# EasyEDA Pro project Daisy.eprj

# Schematic Schematic

## Sheets
1 Daisy: Board Name: Board1; Create Date: 2025-09-15; Page Name: Daisy; Project Name: Daisy; Schematic Name: Schematic; Update Date: 2025-12-15; Company: EasyEDA.com; Drawn: EasyEDA; Page Size: A4; Part Number: JLCPCB-002; Reviewed: EasyEDA; Version: V0.1
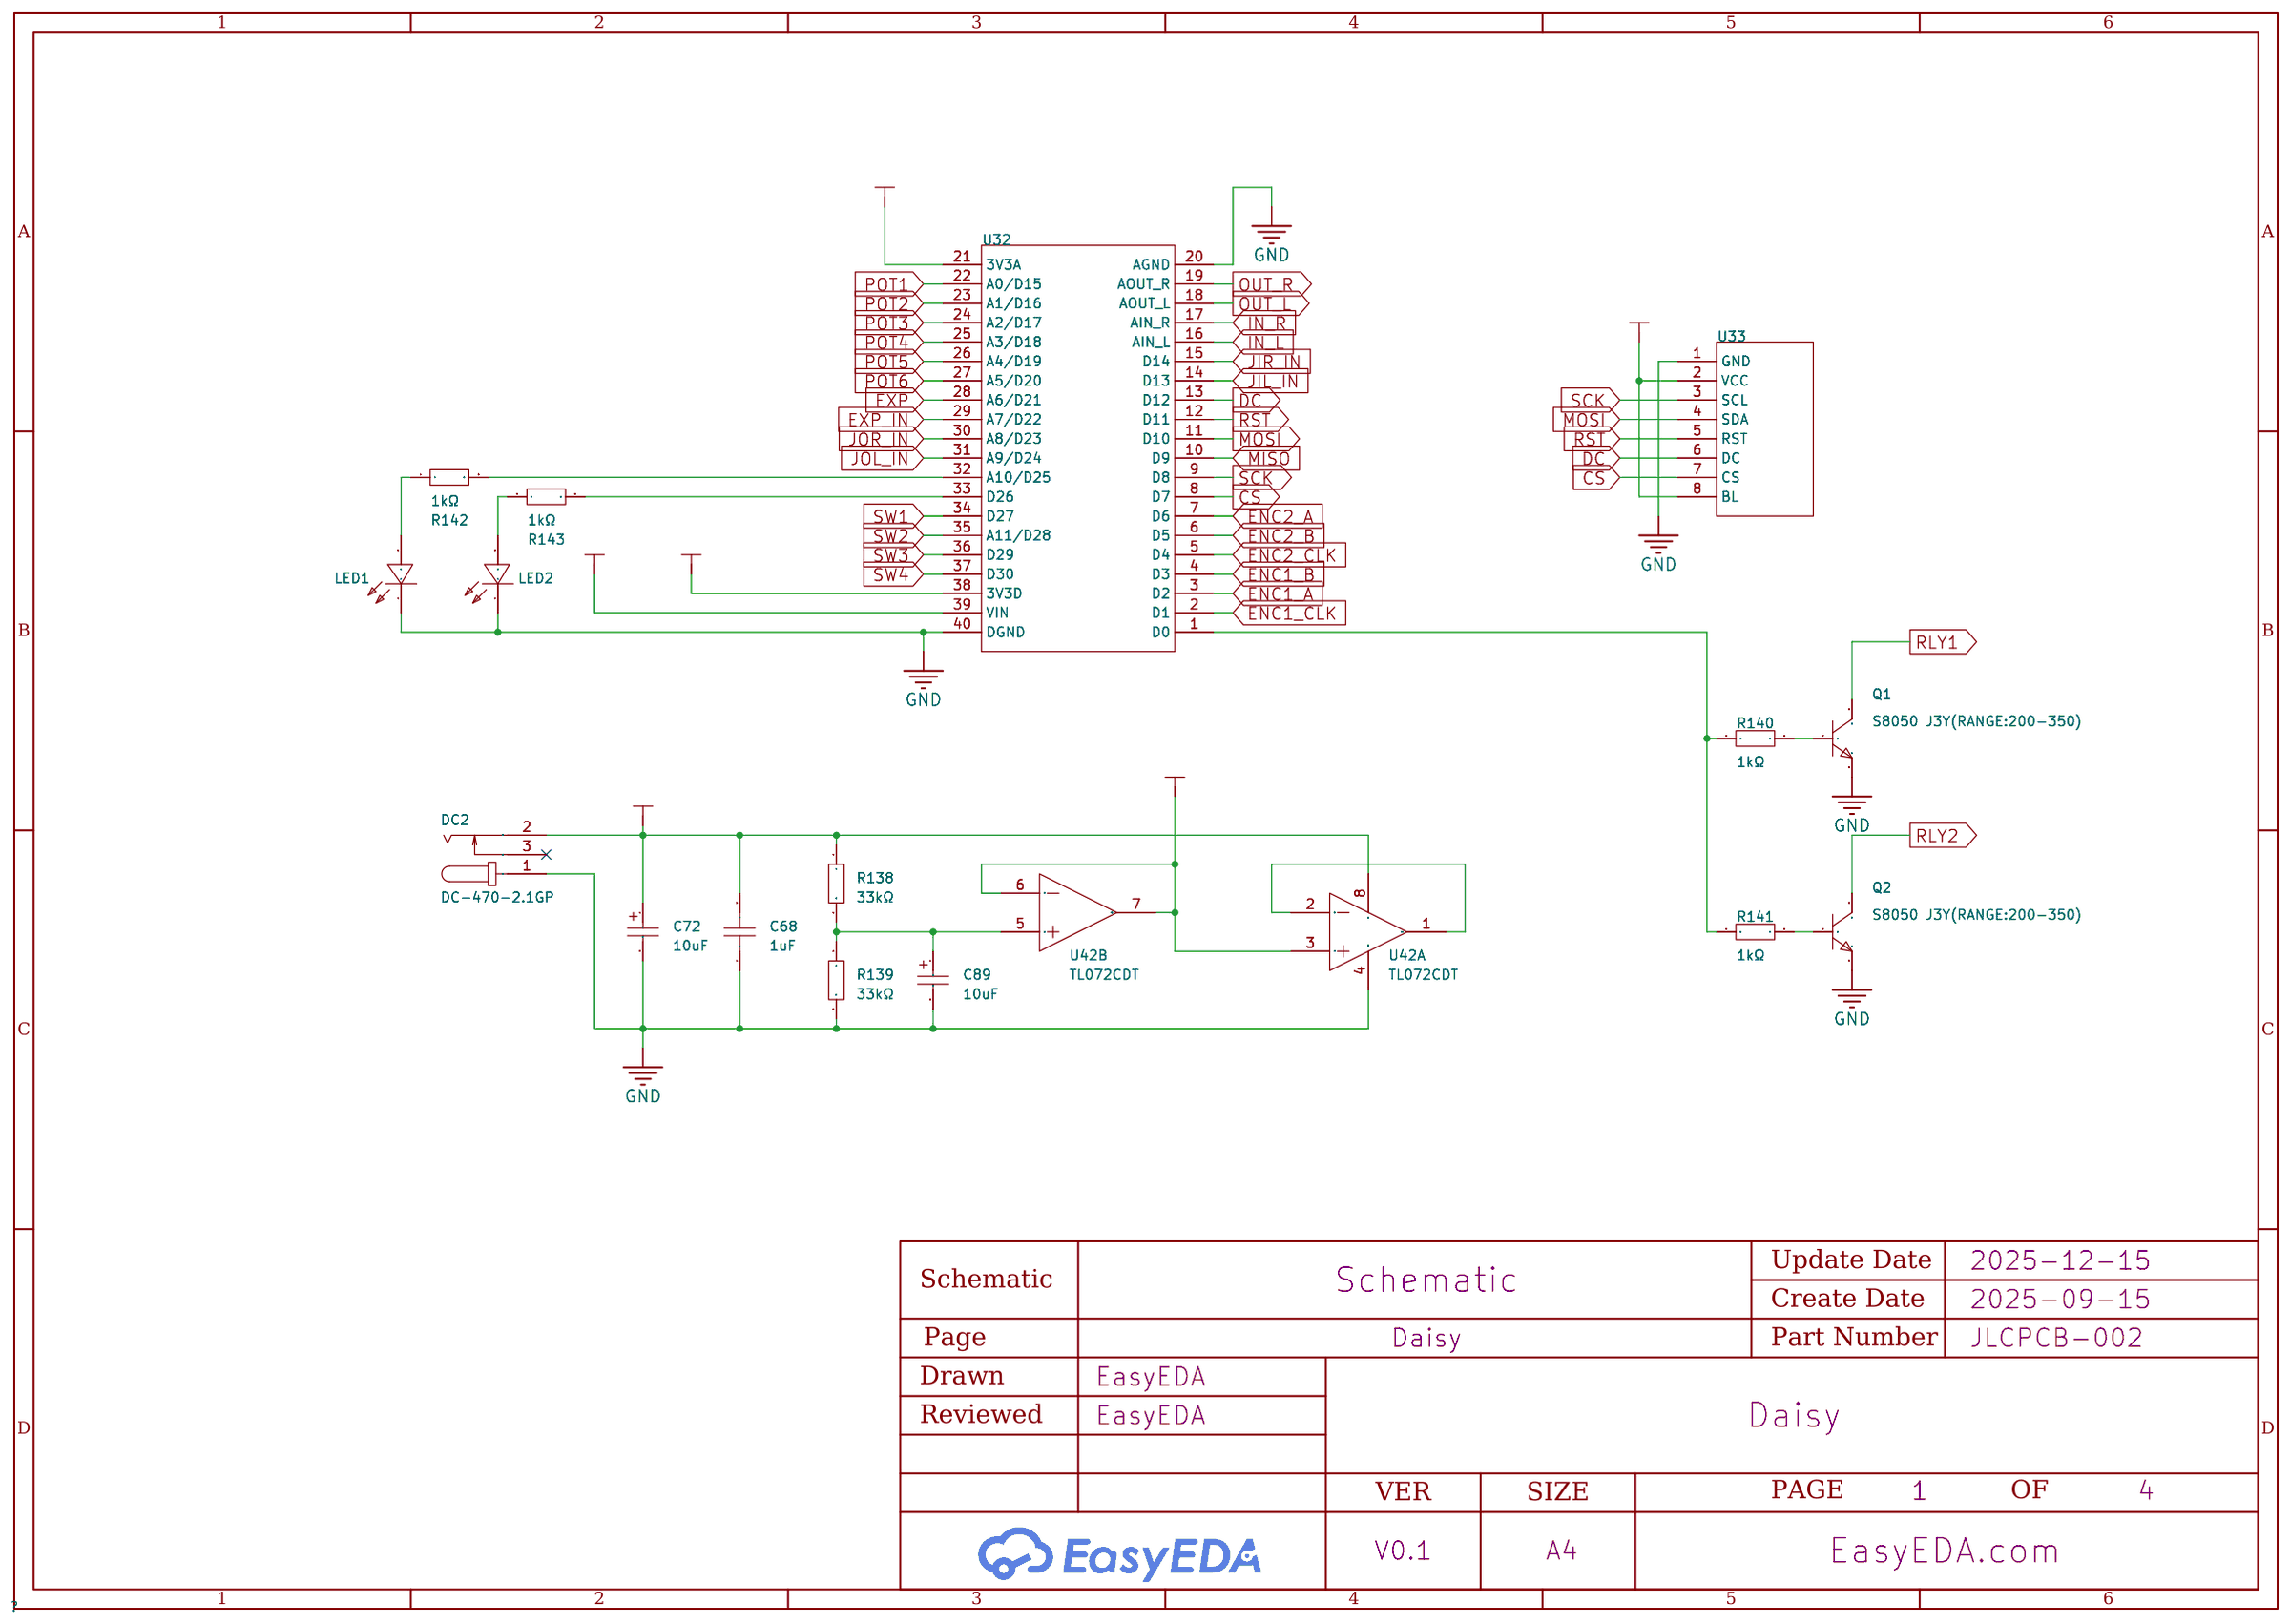
[diagram p0: Daisy]
2 Input Output: Create Date: 2025-12-09; Page Name: Input Output; Update Date: 2025-12-16
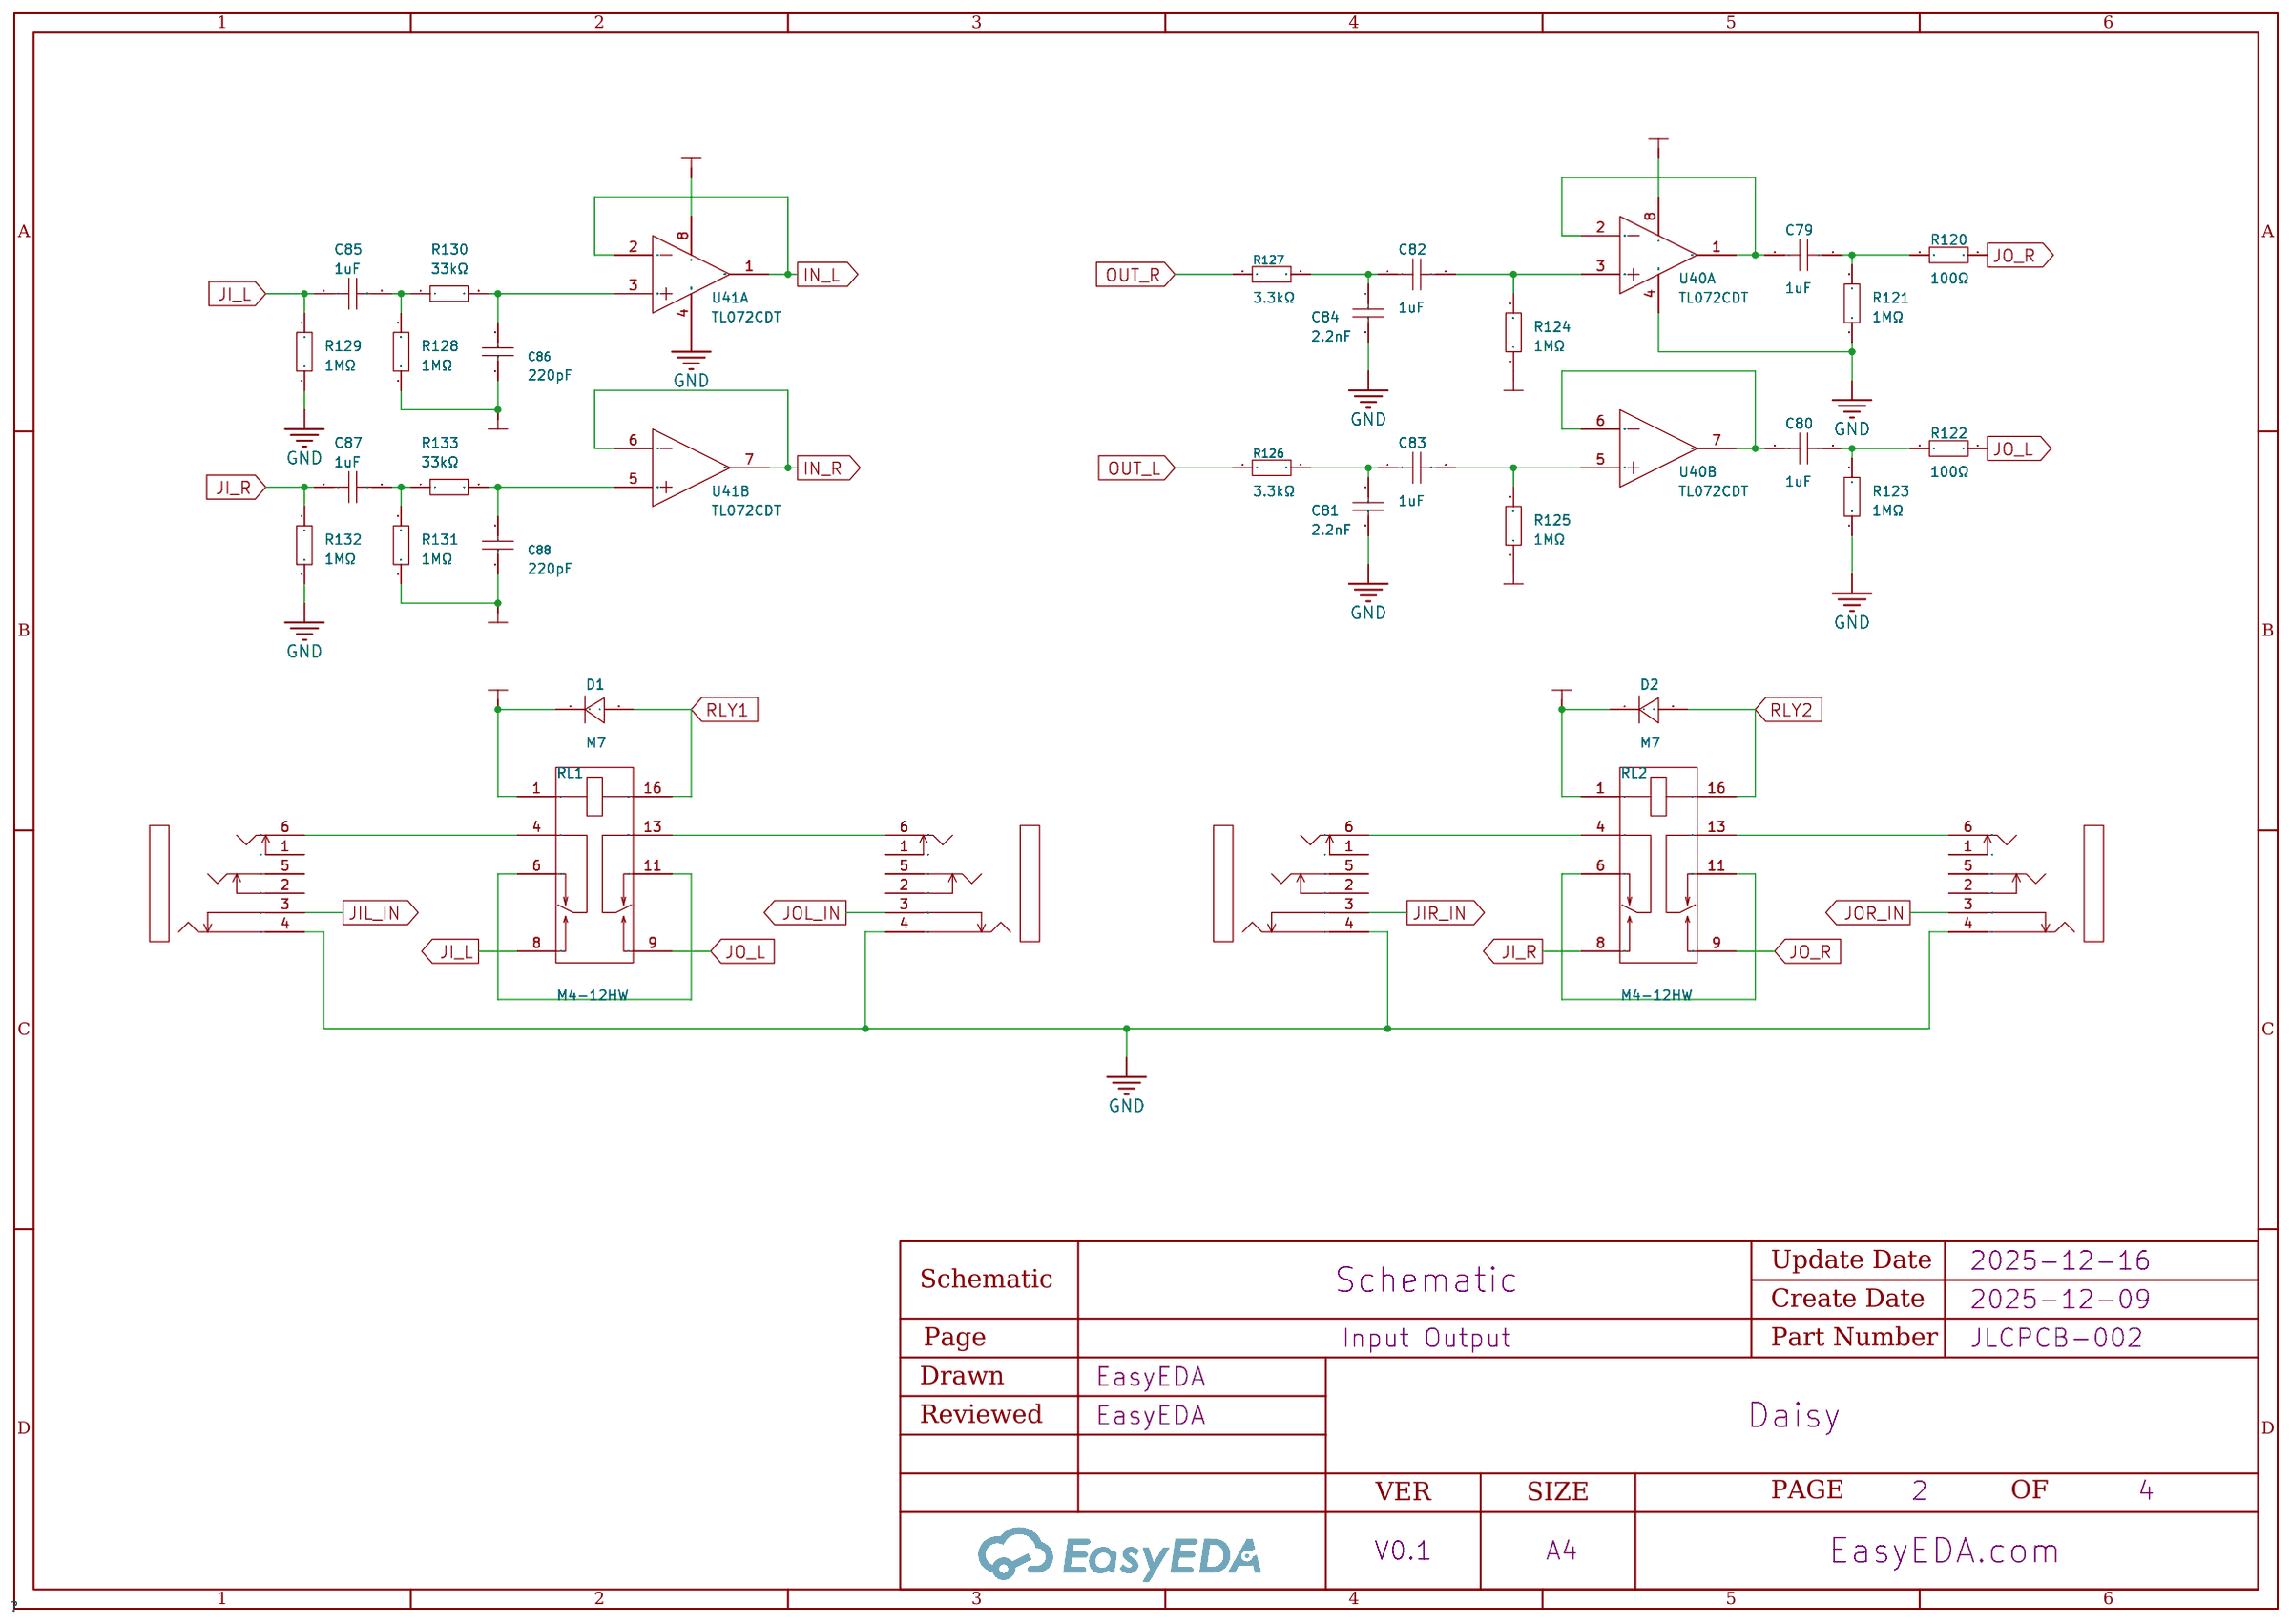
[diagram p1: Input Output]
3 Potentiometers: Create Date: 2025-12-15; Page Name: Potentiometers; Update Date: 2026-02-11
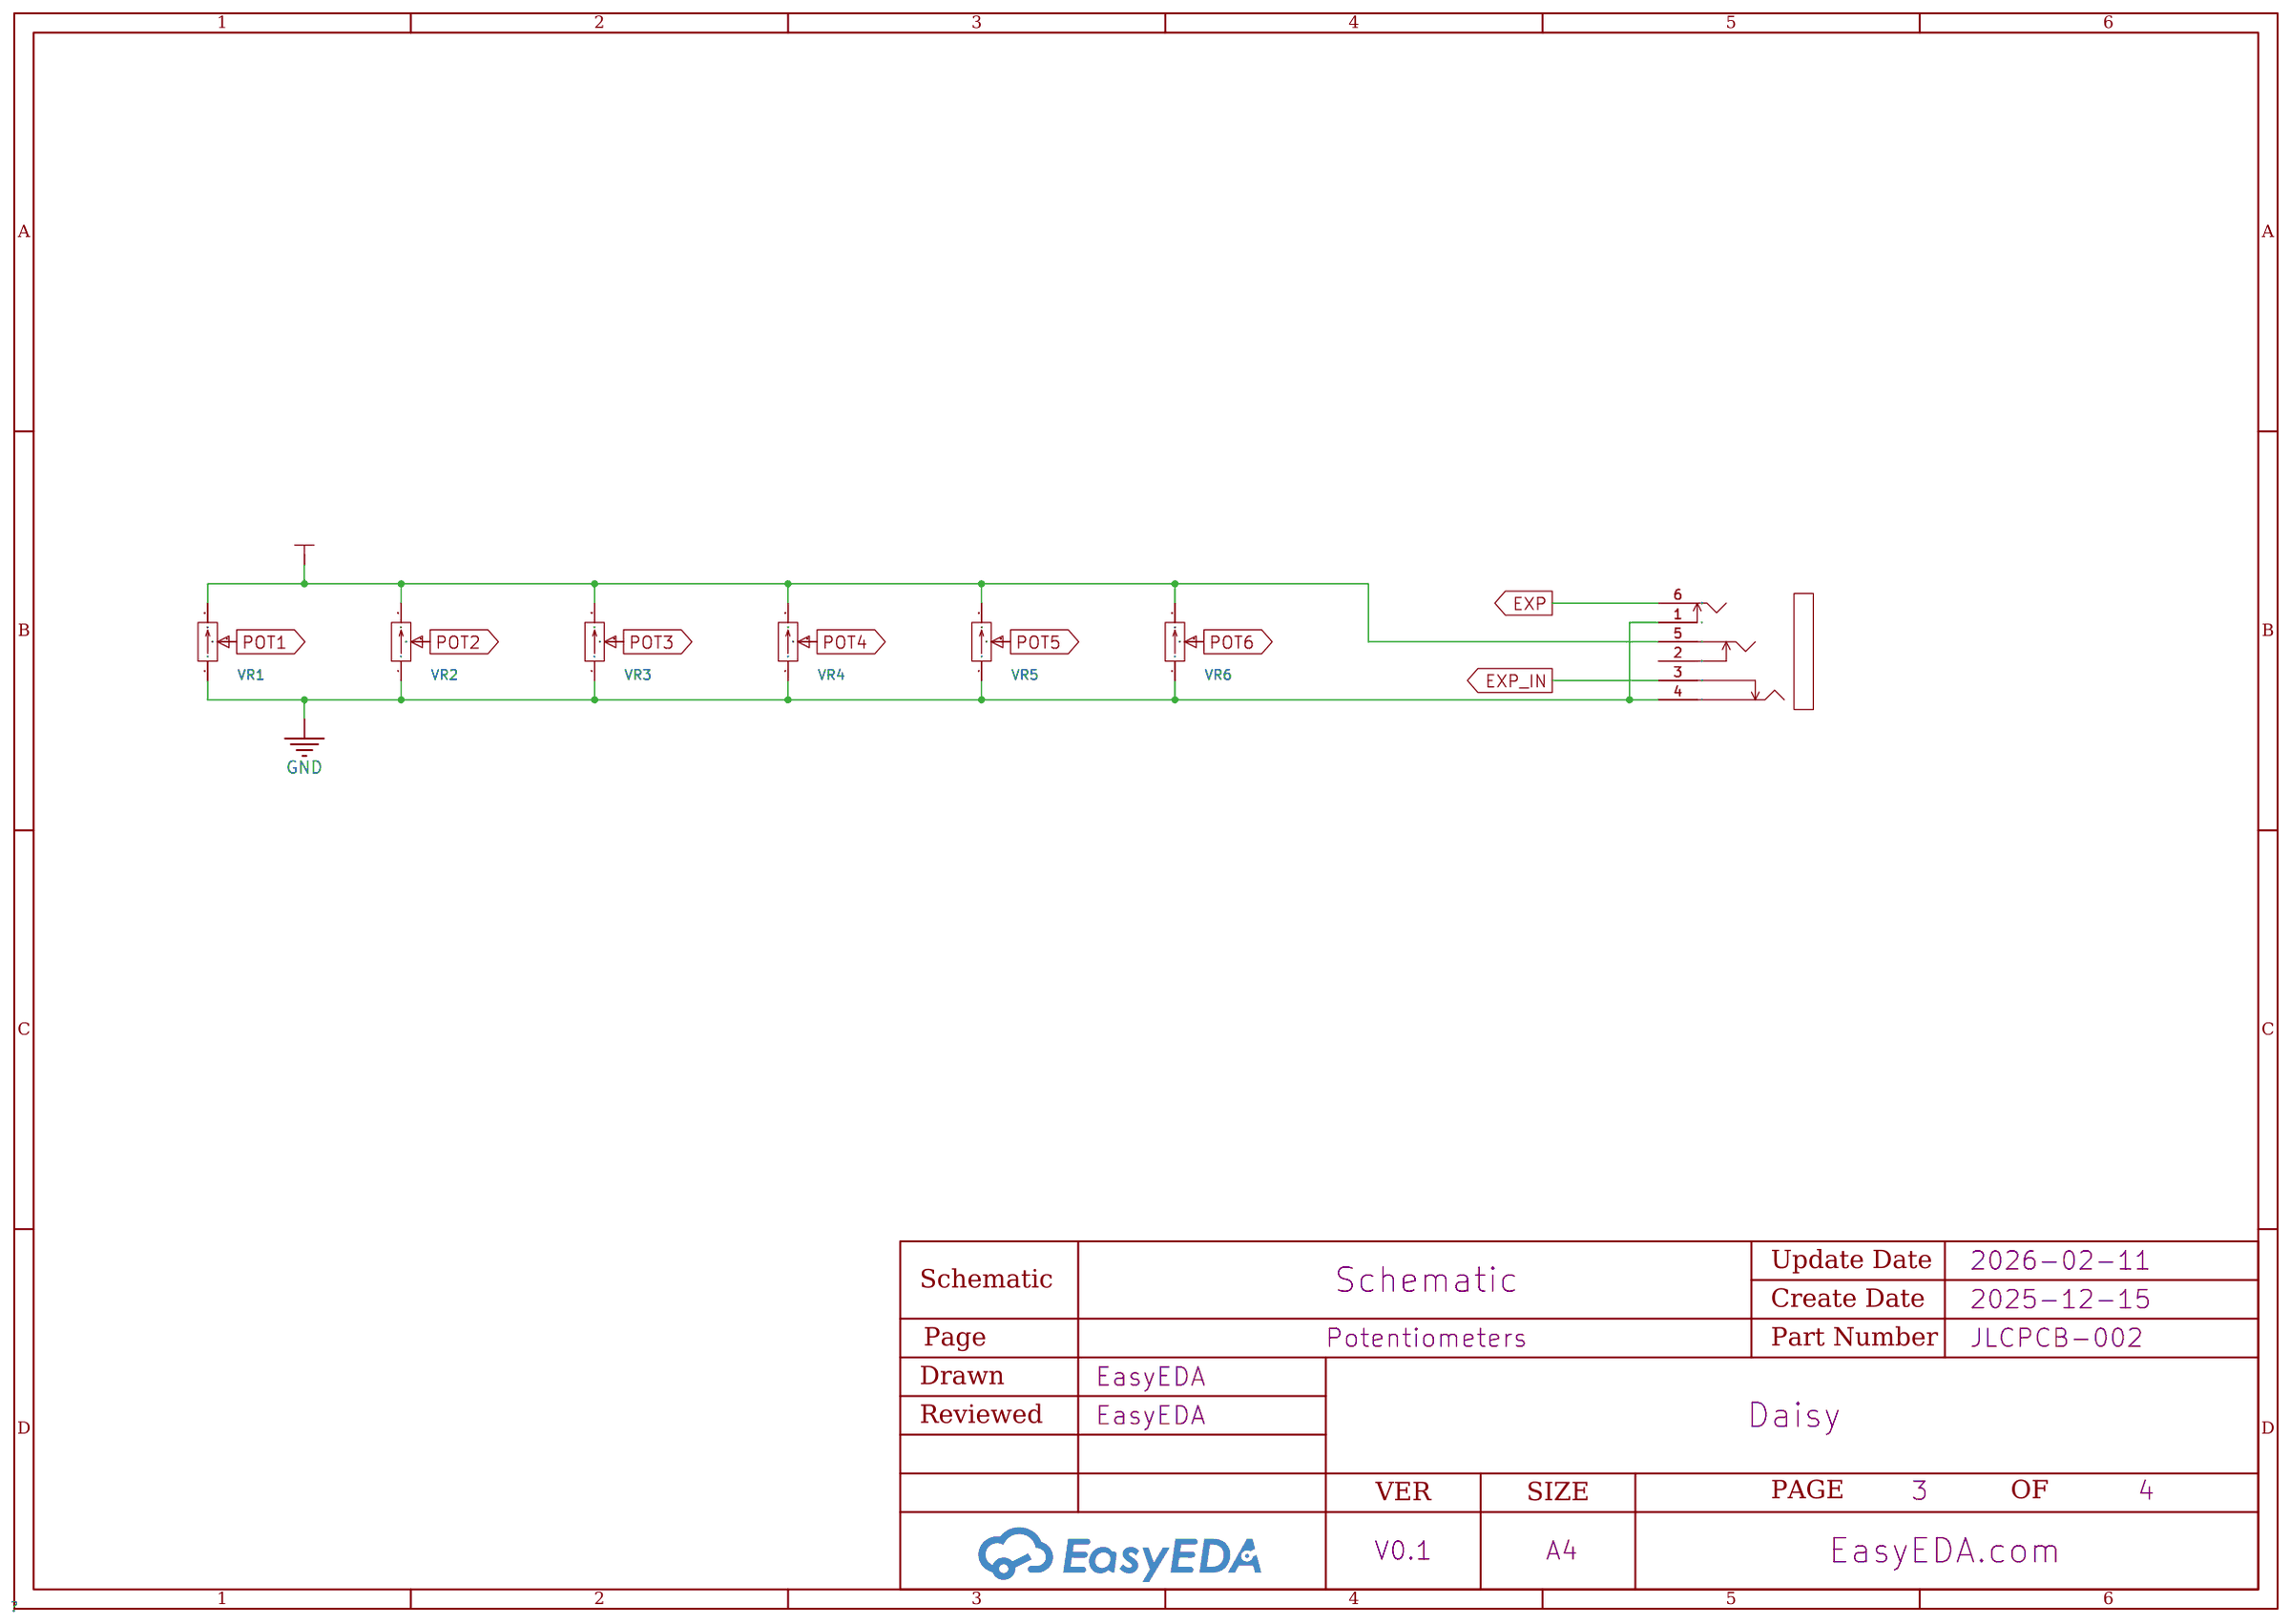
[diagram p2: Potentiometers]
4 Switches: Create Date: 2025-12-15; Page Name: Switches; Update Date: 2026-03-27
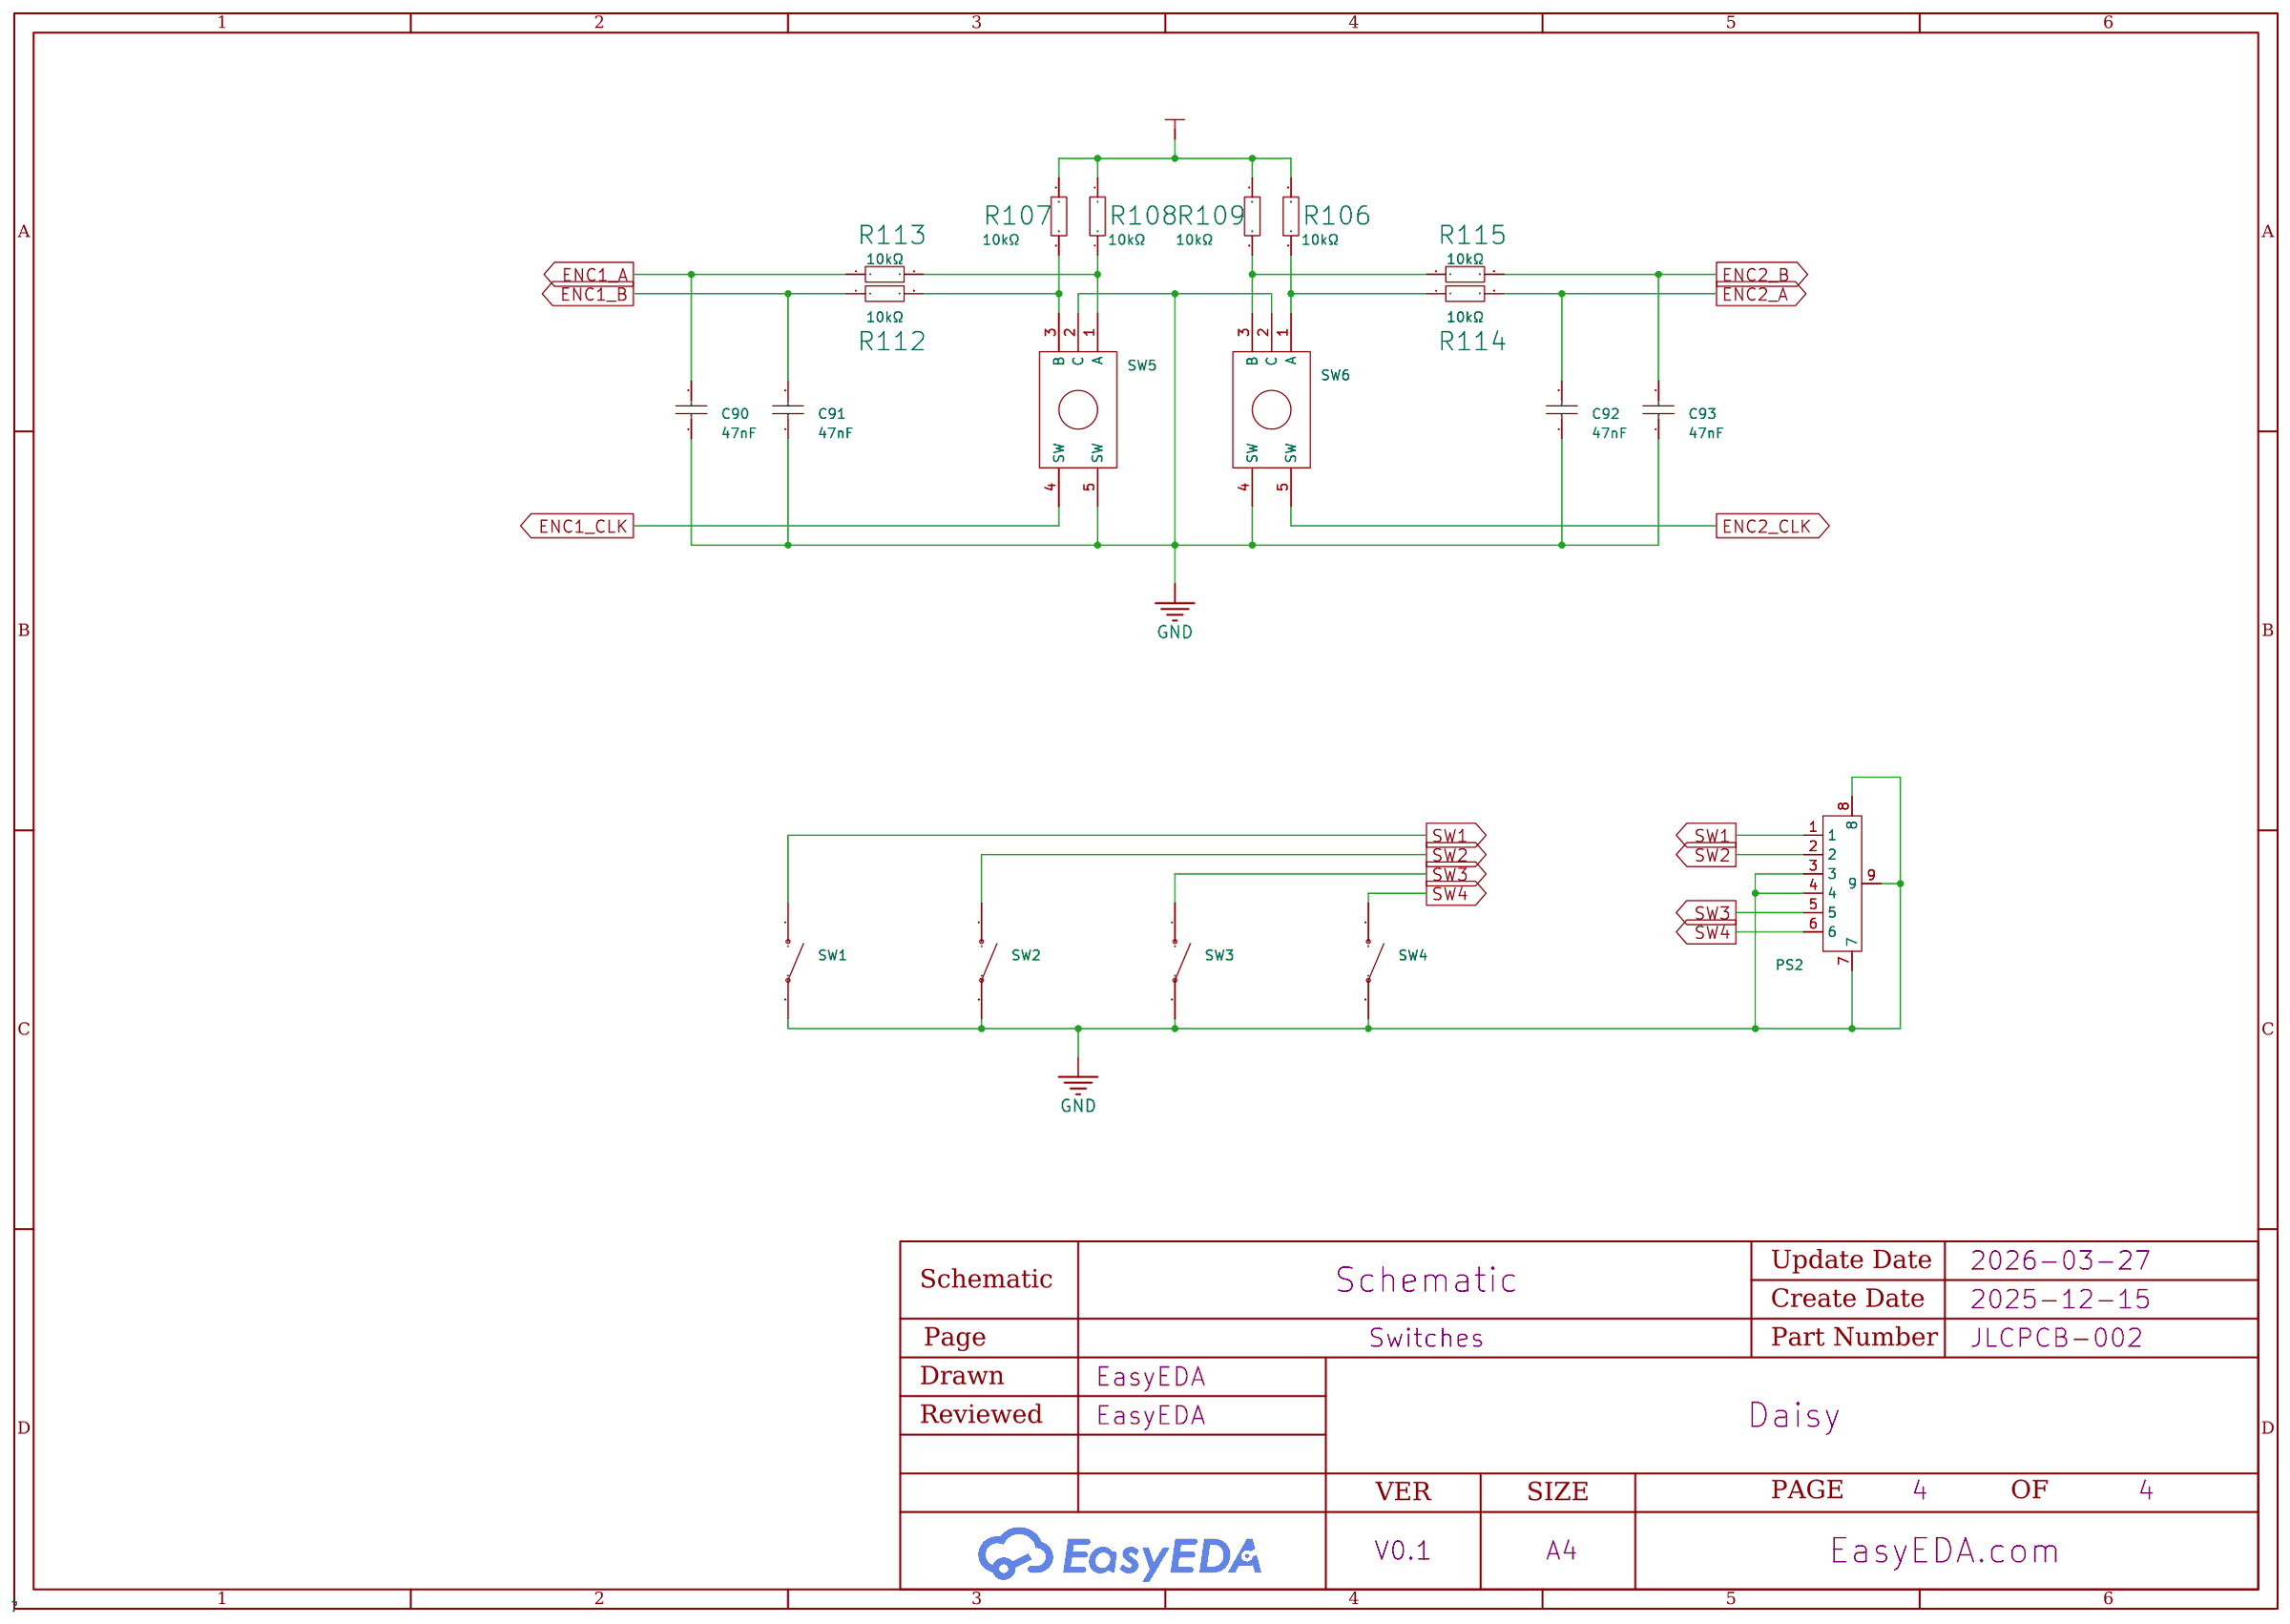
[diagram p3: Switches]

## Parts
sheet Daisy
C68  1uF  [C0603]
C72  10uF  [CAP-SMD_L3.2-W1.6-RD-C7171]
C89  10uF  [CAP-SMD_L3.2-W1.6-RD-C7171]
DC2  DC-470-2.1GP  [DC-IN-TH_DC-470-2.1GP]  (no BOM)
LED1  KT-0603R  [LED0603-RD]
LED2  KT-0603R  [LED0603-RD]
Q1  S8050 J3Y(RANGE:200-350)  [SOT-23-3_L3.0-W1.7-P0.95-LS2.9-BR]
Q2  S8050 J3Y(RANGE:200-350)  [SOT-23-3_L3.0-W1.7-P0.95-LS2.9-BR]
R138  33kΩ  [R0603]
R139  33kΩ  [R0603]
R140  1kΩ  [R0603]
R141  1kΩ  [R0603]
R142  1kΩ  [R0603]
R143  1kΩ  [R0603]
U32  -  [Daisy Seed]  (no BOM)
U33  -  [2.4 TFT Display]  (no BOM)
U42  TL072CDT  [SOIC-8_L5.0-W4.0-P1.27-LS6.0-BL]  (sections 1,2)
sheet Input Output
C79  1uF  [C0603]
C80  1uF  [C0603]
C81  2.2nF  [C0603]
C82  1uF  [C0603]
C83  1uF  [C0603]
C84  2.2nF  [C0603]
C85  1uF  [C0603]
C86  220pF  [C0603]
C87  1uF  [C0603]
C88  220pF  [C0603]
D1  M7  [SMA_L4.3-W2.6-LS5.2-RD]
D2  M7  [SMA_L4.3-W2.6-LS5.2-RD]
J1  -  [Stereo Switched Jack]  (no BOM)
J2  -  [Stereo Switched Jack]  (no BOM)
J3  -  [Stereo Switched Jack]  (no BOM)
J4  -  [Stereo Switched Jack]  (no BOM)
R120  100Ω  [R0603]
R121  1MΩ  [R0603]
R122  100Ω  [R0603]
R123  1MΩ  [R0603]
R124  1MΩ  [R0603]
R125  1MΩ  [R0603]
R126  3.3kΩ  [R0603]
R127  3.3kΩ  [R0603]
R128  1MΩ  [R0603]
R129  1MΩ  [R0603]
R130  33kΩ  [R0603]
R131  1MΩ  [R0603]
R132  1MΩ  [R0603]
R133  33kΩ  [R0603]
RL1  M4-12HW  [RELAYS-TH_M4-XXHXX]  (no BOM)
RL2  M4-12HW  [RELAYS-TH_M4-XXHXX]  (no BOM)
U40  TL072CDT  [SOIC-8_L5.0-W4.0-P1.27-LS6.0-BL]  (sections 1,2)
U41  TL072CDT  [SOIC-8_L5.0-W4.0-P1.27-LS6.0-BL]  (sections 1,2)
sheet Potentiometers
J5  -  [Stereo Switched Jack]  (no BOM)
VR1  -  [RD901F]  (no BOM)
VR2  -  [RD901F]  (no BOM)
VR3  -  [RD901F]  (no BOM)
VR4  -  [RD901F]  (no BOM)
VR5  -  [RD901F]  (no BOM)
VR6  -  [RD901F]  (no BOM)
sheet Switches
C90  47nF  [C0603]
C91  47nF  [C0603]
C92  47nF  [C0603]
C93  47nF  [C0603]
PS2  HYC03-MDC603-128B  [CONN-TH_HYC_HYC03-MDC603-128B]
R106  10kΩ  [R0603]
R107  10kΩ  [R0603]
R108  10kΩ  [R0603]
R109  10kΩ  [R0603]
R112  10kΩ  [R0603]
R113  10kΩ  [R0603]
R114  10kΩ  [R0603]
R115  10kΩ  [R0603]
SW1  -  [Tactile Switch 6mm]  (no BOM)
SW2  -  [Tactile Switch 6mm]  (no BOM)
SW3  -  [Tactile Switch 6mm]  (no BOM)
SW4  -  [Tactile Switch 6mm]  (no BOM)
SW5  -  [12mm Encoder]  (no BOM)
SW6  -  [12mm Encoder]  (no BOM)

## Library data of the parts
C68 C79 C80 C82 C83 C85 C87 = CL10A105KB8NNNC: Capacitance: Tolerance:±10% Tolerance:±10% Voltage Rated: Temperature Coefficient:; LCSC Part Name: 1uF ±10% 50V; Supplier Part: C15849; Manufacturer: SAMSUNG(三星); Supplier Footprint: 0603; JLCPCB Part Class: Basic Part; Datasheet: https://atta.szlcsc.com/upload/public/pdf/source/20160218/1457707763339.pdf; Supplier: LCSC; Tolerance: ±10%
C72 C89 = TAJA106K016RNJ: LCSC Part Name: 10uF ±10% 16V; Supplier Part: C7171; Manufacturer: Kyocera AVX; Supplier Footprint: CASE-A-3216-18(mm); JLCPCB Part Class: Basic Part; Supplier: LCSC; Tolerance: ±10%; Voltage Rating: 16V; Equivalent Series Resistance(ESR): 3Ω@100kHz; Operating Temperature: -55℃~+125℃
DC2 = DC-470-2.1GP: Connector Type:DC Power Receptacle Mounting Style:Right-Angle Inside Contact Diameter:2.1mm Outside Contact Diameter:6.3mm Current Rating (Max):500mA Voltage Rating (Max):30V Contact Material:- Contact Plating:- Operating Temperature Range:-40℃~+55℃ Opera; LCSC Part Name: DC电源插座 内径:2.1mm 外径:6.3mm; Supplier Part: C194407; Manufacturer: GANGYUAN(港源); Supplier Footprint: 插件; JLCPCB Part Class: Extended Part; Datasheet: https://atta.szlcsc.com/upload/public/pdf/source/20180622/C194407_A8415BB52DCD8B2707DD756772886C27.pdf; Supplier: LCSC; Connector Type: DC Power Receptacle; Mounting Style: Right-Angle; Inside Contact Diameter: 2.1mm; Outside Contact Diameter: 6.3mm; Current Rating (Max): 500mA; Voltage Rating (Max): 30V; Operating Temperature Range: -40℃~+55℃
LED1 LED2 = KT-0603R: LCSC Part Name: 0603 红灯 高亮; Supplier Part: C2286; Manufacturer: KENTO; Supplier Footprint: 0603; JLCPCB Part Class: Basic Part; Datasheet: https://atta.szlcsc.com/upload/public/pdf/source/20160616/1466072038404.pdf; Supplier: LCSC; Emitted Color: Red; Operating Temperature: -40℃~+85℃
Q1 Q2 = S8050 J3Y(RANGE:200-350): LCSC Part Name: H档(200-350) NPN 电流:0.5A 电压:25V; Supplier Part: C2146; Manufacturer: CJ(江苏长电/长晶); Supplier Footprint: SOT-23; JLCPCB Part Class: Basic Part; Datasheet: https://item.szlcsc.com/datasheet/S8050%2520J3Y(RANGE%253A200-350)/2503.html; Supplier: LCSC; type: NPN; Current - Collector(Ic): 500mA; Collector - Emitter Voltage VCEO: 25V; Pd - Power Dissipation: 300mW; DC Current Gain: 200@500mA,1V; Transition frequency(fT): 150MHz; Current - Collector Cutoff: 100nA; Vce Saturation(VCE(sat)): 600mV@500mA,50mA; Operating Temperature: -55℃~+150℃; Emitter-Base Voltage(Vebo): 5V; Number: 1 NPN
R130 R133 R138 R139 = 0603WAF3302T5E: Type:Thick Film Resistors Resistance:33kΩ Tolerance:±1% Tolerance:±1% Power(Watts): Overload Voltage (Max): Temperature Coefficient:±100ppm/℃ Temperature Coefficient:±100ppm/℃ Operating Temperature Range:-55℃~+155℃ Operating Temperature Range:-55℃~+155℃; LCSC Part Name: 33kΩ ±1% 100mW 厚膜电阻; Supplier Part: C4216; Manufacturer: UNI-ROYAL(厚声); Supplier Footprint: 0603; JLCPCB Part Class: Basic Part; Datasheet: https://atta.szlcsc.com/upload/public/pdf/source/20200306/C422600_1E6D84923E4A46A82E41ADD87F860B5C.pdf; Supplier: LCSC; Type: Thick Film Resistors; Tolerance: ±1%; Temperature Coefficient: ±100ppm/℃; Operating Temperature Range: -55℃~+155℃
R140-R143 = 0603WAF1001T5E: LCSC Part Name: 1kΩ ±1% 100mW 厚膜电阻; Supplier Part: C21190; Manufacturer: UNI-ROYAL(厚声); Supplier Footprint: 0603; JLCPCB Part Class: Basic Part; Datasheet: https://atta.szlcsc.com/upload/public/pdf/source/20200306/C422600_1E6D84923E4A46A82E41ADD87F860B5C.pdf; Supplier: LCSC; Type: Thick Film Resistors; Tolerance: ±1%; Temperature Coefficient: ±100ppm/℃; Operating Temperature Range: -55℃~+155℃
U32 = Daisy Seed
U33 = LCD Display 2.4
U40-U42 = TL072CDT: Number of Channels:- Gain Bandwidth Product:4MHz Ib - Input Bias Current:20pA Vos - Input Offset Voltage:3mV Common Mode Rejection Ratio(CMRR):86dB Slew Rate:16V/us Quiescent Current(Iq):1.4mA Rail To Rail:- Input Offset Voltage Drift(Vos TC):10uV/℃ Input; Supplier Part: C6961; Manufacturer: ST(意法半导体); Supplier Footprint: SO-8; JLCPCB Part Class: Basic Part; Datasheet: https://item.szlcsc.com/datasheet/TL072CDT/7433.html; Supplier: LCSC; Number of Circuits: 双路; Gain Bandwidth Product(GBP): 4MHz; Current - Input Bias(Ib): 20pA; Voltage - Input Offset(Vos): 3mV; Slew Rate(SR): 16V/us; Supply Current Per Channel: 2.5mA; Gain Bandwidth Product: 4MHz; Ib - Input Bias Current: 20pA; Vos - Input Offset Voltage: 3mV; Common Mode Rejection Ratio(CMRR): 86dB; Slew Rate: 16V/us; Quiescent Current(Iq): 1.4mA; Input Offset Voltage Drift(Vos TC): 10uV/℃
C81 C84 = 0603B222K500NT: Capacitance:2.2nF Tolerance:±10% Tolerance:±10% Voltage Rated: Temperature Coefficient:; LCSC Part Name: 2.2nF ±10% 50V; Supplier Part: C1604; Manufacturer: FH(风华); Supplier Footprint: 0603; JLCPCB Part Class: Basic Part; Datasheet: https://atta.szlcsc.com/upload/public/pdf/source/20200305/C486355_26A10D38EF8C2A5C37091D0039909270.pdf; Supplier: LCSC; Tolerance: ±10%
C86 C88 = CL10B221KB8NNNC: LCSC Part Name: 220pF ±10% 50V; Supplier Part: C1603; Manufacturer: SAMSUNG(三星); Supplier Footprint: 0603; JLCPCB Part Class: Basic Part; Datasheet: https://atta.szlcsc.com/upload/public/pdf/source/20160218/1457707763339.pdf; Supplier: LCSC; Tolerance: ±10%
D1 D2 = M7_C95872: LCSC Part Name: 1kV 1A; Supplier Part: C95872; Manufacturer: MDD(辰达半导体); Supplier Footprint: SMA(DO-214AC); JLCPCB Part Class: Basic Part; Datasheet: https://item.szlcsc.com/datasheet/M7/97076.html; Supplier: LCSC; Diode Configuration: Independent; Voltage - Forward(Vf@If): 1.1V@1A; Voltage - DC Reverse(Vr): 1kV; Current - Rectified: 1A; Reverse Leakage Current (Ir): 5uA@1kV; Non-Repetitive Peak Forward Surge Current: 30A; Operating Junction Temperature Range: -55℃~+150℃
J1-J5 = Stereo Switched Jack Socket
R120 R122 = 0603WAF1000T5E: Type:Thick Film Resistors Resistance: Tolerance:±1% Tolerance:±1% Power(Watts): Overload Voltage (Max): Temperature Coefficient:±200ppm/℃ Temperature Coefficient:±200ppm/℃ Operating Temperature Range:-55℃~+155℃ Operating Temperature Range:-55℃~+155℃; LCSC Part Name: 100Ω ±1% 100mW 厚膜电阻; Supplier Part: C22775; Manufacturer: UNI-ROYAL(厚声); Supplier Footprint: 0603; JLCPCB Part Class: Basic Part; Datasheet: https://atta.szlcsc.com/upload/public/pdf/source/20200306/C422600_1E6D84923E4A46A82E41ADD87F860B5C.pdf; Supplier: LCSC; Type: Thick Film Resistors; Tolerance: ±1%; Temperature Coefficient: ±200ppm/℃; Operating Temperature Range: -55℃~+155℃
R121 R123-R125 R128 R129 R131 R132 = 0603WAF1004T5E: Type:Thick Film Resistors Resistance:1MΩ Tolerance:±1% Tolerance:±1% Power(Watts): Overload Voltage (Max): Temperature Coefficient:±100ppm/℃ Temperature Coefficient:±100ppm/℃ Operating Temperature Range:-55℃~+155℃ Operating Temperature Range:-55℃~+155℃; LCSC Part Name: 1MΩ ±1% 100mW 厚膜电阻; Supplier Part: C22935; Manufacturer: UNI-ROYAL(厚声); Supplier Footprint: 0603; JLCPCB Part Class: Basic Part; Datasheet: https://atta.szlcsc.com/upload/public/pdf/source/20200306/C422600_1E6D84923E4A46A82E41ADD87F860B5C.pdf; Supplier: LCSC; Type: Thick Film Resistors; Tolerance: ±1%; Temperature Coefficient: ±100ppm/℃; Operating Temperature Range: -55℃~+155℃
R126 R127 = 0603WAF3301T5E: LCSC Part Name: 3.3kΩ ±1% 100mW 厚膜电阻; Supplier Part: C22978; Manufacturer: UNI-ROYAL(厚声); Supplier Footprint: 0603; JLCPCB Part Class: Basic Part; Datasheet: https://item.szlcsc.com/datasheet/0603WAF3301T5E/23705.html; Supplier: LCSC; Type: Thick Film Resistor; Tolerance: ±1%; Power(Watts): 100mW; Voltage-Supply(Max): 75V; Temperature Coefficient: ±100ppm/℃; Operating Temperature: -55℃~+155℃
RL1 RL2 = M4-12HW: LCSC Part Name: 双列式高灵敏型继电器; Supplier Part: C7529196; Manufacturer: NF(福特); Supplier Footprint: DIP; JLCPCB Part Class: Extended Part; Datasheet: https://item.szlcsc.com/datasheet/M4-12HW/8628812.html; Supplier: LCSC; Coil Voltage: 12V; Contact Form: 2 Form C: 2C (DPDT-CO); Contact Rating: 2A@30VDC；1A@24VDC；500mA@120VAC; Switching Voltage(Max): 250V@AC；220V@DC; Coil Rated Power: 150mW; Contact Material: AgNi + Gold plated; Switching Current(Max): 2A; Coil Resistance: 960Ω; Contact Resistance: 50mΩ; Operate Time: 4.5ms; Release Time: 1.5ms; Operating Temperature: -40℃~+90℃
VR1-VR6 = RD901F: Resistance: B10K
C90-C93 = CL10B473KB8NNNC: LCSC Part Name: 47nF ±10% 50V; Supplier Part: C1622; Manufacturer: SAMSUNG(三星); Supplier Footprint: 0603; JLCPCB Part Class: Basic Part; Datasheet: https://item.szlcsc.com/datasheet/CL10B473KB8NNNC/1974.html; Supplier: LCSC; Tolerance: ±10%; Voltage Rating: 50V; Temperature Coefficient: X7R
PS2 = HYC03-MDC603-128B: LCSC Part Name: S端子连接器 HYC03-MDC603-128B; Supplier Part: C2926814; Manufacturer: 华宇创; Supplier Footprint: 插件; JLCPCB Part Class: Extended Part; Datasheet: https://item.szlcsc.com/datasheet/HYC03-MDC603-128B/3251473.html; Supplier: LCSC
R106-R109 R112-R115 = 0603WAF1002T5E: Type:Thick Film Resistor Resistance:10kΩ Tolerance:±1% Tolerance:±1% Power(Watts):100mW Voltage-Supply(Max):75V Temperature Coefficient:±100ppm/℃ Temperature Coefficient:±100ppm/℃ Operating Temperature:-55℃~+155℃ Operating Temperature:-55℃~+155℃; LCSC Part Name: 厚膜电阻 10kΩ ±1% 100mW; Supplier Part: C25804; Manufacturer: UNI-ROYAL(厚声); Supplier Footprint: 0603; JLCPCB Part Class: Basic Part; Datasheet: https://atta.szlcsc.com/upload/public/pdf/source/20200306/C422600_1E6D84923E4A46A82E41ADD87F860B5C.pdf; Supplier: LCSC; Type: Thick Film Resistor; Tolerance: ±1%; Power(Watts): 100mW; Temperature Coefficient: ±100ppm/℃; Voltage-Supply(Max): 75V; Operating Temperature: -55℃~+155℃
SW1-SW4 = Tactile Switch
SW5 SW6 = Rotary Encoder w Switch

## Nets
3V3A: J5.5 U32.21(3V3A) VR1.3 VR2.3 VR3.3 VR4.3 VR5.3 VR6.3
3V3D: R106.1 R107.1 R108.1 R109.1 U32.38(3V3D) U33.2(VCC) U33.8(BL)
+9V: C68.2 C72.1 D1.1(K) D2.1(K) DC2.2 R138.1 RL1.1 RL2.1 U32.39(VIN) U40.8(VCC+) U41.8(VCC+) U42.8(VCC+)
GND: C68.1 C72.2 C81.2 C84.2 C89.2 C90.1 C91.1 C92.1 C93.1 DC2.1 J1.4 J2.4 J3.4 J4.4 J5.1 J5.4 LED1.1(K) LED2.1(K) PS2.3 PS2.4 PS2.7 PS2.8 PS2.9 Q1.2(E) Q2.2(E) R121.1 R123.1 R129.1 R132.1 R139.2 SW1.2 SW2.2 SW3.2 SW4.2 SW5.2(C) SW5.5(SW) SW6.2(C) SW6.4(SW) U32.20(AGND) U32.40(DGND) U33.1(GND) U40.4(VCC-/GND) U41.4(VCC-/GND) U42.4(VCC-/GND) VR1.1 VR2.1 VR3.1 VR4.1 VR5.1 VR6.1
CS: U32.8(D7) U33.7(CS)
DC: U32.13(D12) U33.6(DC)
ENC1_A: C90.2 R113.1 U32.3(D2)
ENC1_B: C91.2 R112.1 U32.4(D3)
ENC1_CLK: SW5.4(SW) U32.2(D1)
ENC2_A: C92.2 R114.2 U32.7(D6)
ENC2_B: C93.2 R115.2 U32.6(D5)
ENC2_CLK: SW6.5(SW) U32.5(D4)
EXP: J5.6 U32.28(A6/D21)
EXP_IN: J5.3 U32.29(A7/D22)
IN_L: U32.16(AIN_L) U41.1(OUT1) U41.2(IN1-)
IN_R: U32.17(AIN_R) U41.6(IN2-) U41.7(OUT2)
JI_L: C85.1 R129.2 RL1.8
JI_R: C87.1 R132.2 RL2.8
JIL_IN: J1.3 U32.14(D13)
JIR_IN: J2.3 U32.15(D14)
JO_L: R122.2 RL1.9
JO_R: R120.2 RL2.9
JOL_IN: J3.3 U32.31(A9/D24)
JOR_IN: J4.3 U32.30(A8/D23)
MISO: U32.10(D9)
MOSI: U32.11(D10) U33.4(SDA)
OUT_L: R126.1 U32.18(AOUT_L)
OUT_R: R127.1 U32.19(AOUT_R)
POT1: U32.22(A0/D15) VR1.2
POT2: U32.23(A1/D16) VR2.2
POT3: U32.24(A2/D17) VR3.2
POT4: U32.25(A3/D18) VR4.2
POT5: U32.26(A4/D19) VR5.2
POT6: U32.27(A5/D20) VR6.2
RLY1: D1.2(A) Q1.3(C) RL1.16
RLY2: D2.2(A) Q2.3(C) RL2.16
RST: U32.12(D11) U33.5(RST)
SCK: U32.9(D8) U33.3(SCL)
SW1: PS2.1 SW1.1 U32.34(D27)
SW2: PS2.2 SW2.1 U32.35(A11/D28)
SW3: PS2.5 SW3.1 U32.36(D29)
SW4: PS2.6 SW4.1 U32.37(D30)
VREF: C86.1 C88.1 R124.1 R125.1 R128.1 R131.1 U42.3(IN1+) U42.6(IN2-) U42.7(OUT2)
$10N6382: R140.1 R141.1 U32.1(D0)
$10N6679: R142.2 U32.32(A10/D25)
$10N6682: R143.2 U32.33(D26)
$10N7125: C89.1 R138.2 R139.1 U42.5(IN2+)
$10N7367: U42.1(OUT1) U42.2(IN1-)
$10N7624: Q1.1(B) R140.2
$10N7628: Q2.1(B) R141.2
$10N7932: LED2.2(A) R143.1
$10N7953: LED1.2(A) R142.1
$11N804: C79.2 R120.1 R121.2
$11N837: C79.1 U40.1(OUT1) U40.2(IN1-)
$11N1101: C80.2 R122.1 R123.2
$11N1104: C80.1 U40.6(IN2-) U40.7(OUT2)
$11N1398: C83.2 R125.2 U40.5(IN2+)
$11N1403: C82.2 R124.2 U40.3(IN1+)
$11N1606: C82.1 C84.1 R127.2
$11N1632: C81.1 C83.1 R126.2
$11N2089: C85.2 R128.2 R130.1
$11N2090: C86.2 R130.2 U41.3(IN1+)
$11N2346: C87.2 R131.2 R133.1
$11N2347: C88.2 R133.2 U41.5(IN2+)
$11N2676: RL1.6 RL1.11
$11N2773: RL2.6 RL2.11
$11N2916: J1.6 RL1.4
$11N2921: J3.6 RL1.13
$11N2943: J2.6 RL2.4
$11N2980: J4.6 RL2.13
$13N692: R106.2 R114.1 SW6.1(A)
$13N693: R109.2 R115.1 SW6.3(B)
$13N699: R107.2 R112.2 SW5.3(B)
$13N700: R108.2 R113.2 SW5.1(A)

Not connected (* = marked no-connect by the designer): DC2 3*; J1 1 2 5; J2 1 2 5; J3 1 2 5; J4 1 2 5; J5 2

# Board PCB1
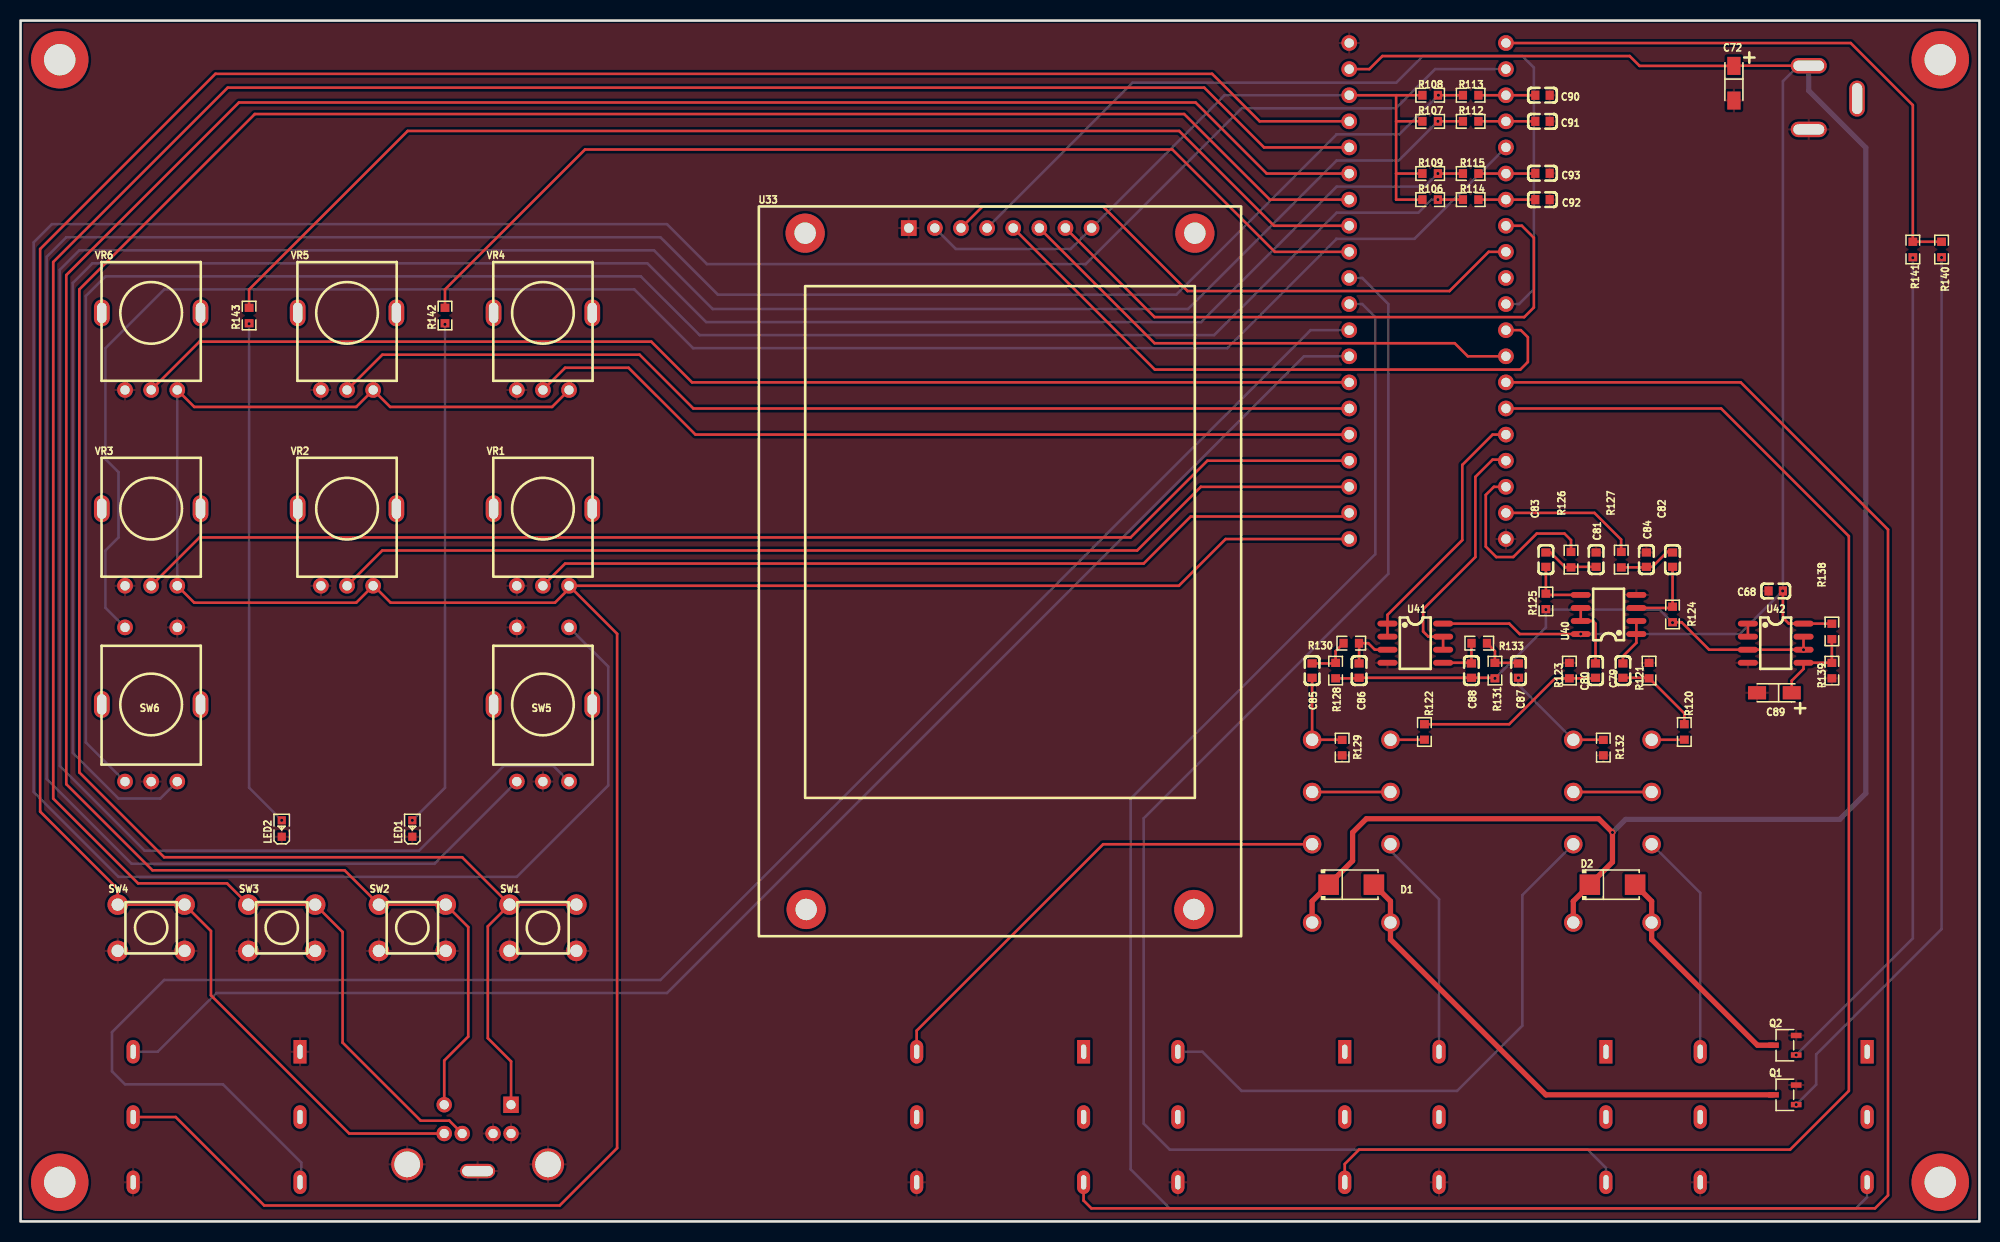
[diagram p4: board, top side]
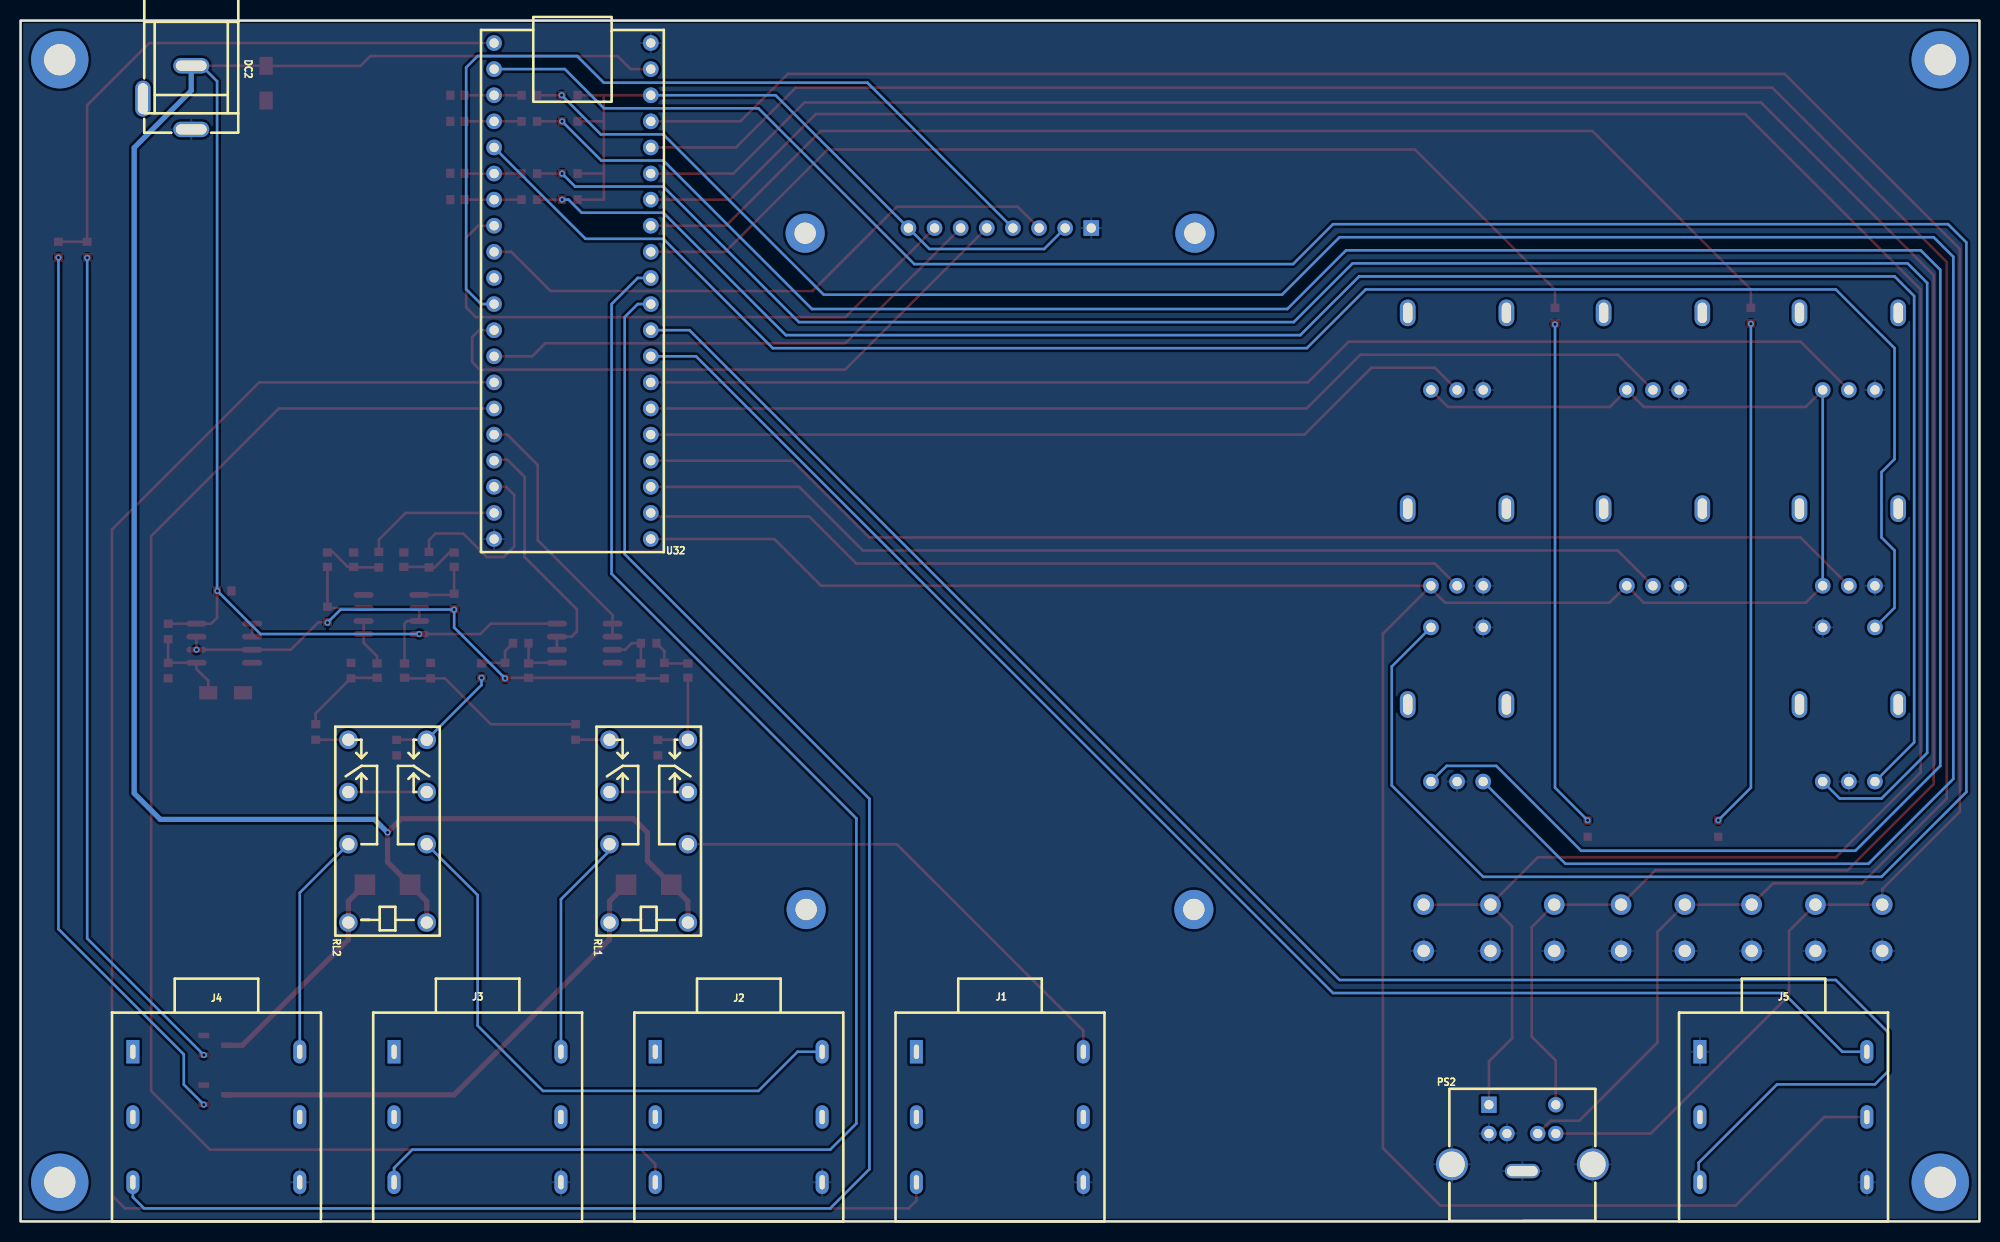
[diagram p5: board, bottom side, seen from below]

Outline 190.5 x 116.84 mm; copper layers: Top Layer, Bottom Layer. Coordinates in mm from the lower left corner of the outline.
Outline path: rectangle 0,116.84 190.5,0
Stack: Top Layer 0.035mm / Dielectric1 1.51mm FR4 er 4.5 / Bottom Layer 0.035mm

## Design rules (mm)
template: JLCPCB Capability(Two Layers Board)
spacing copperThickness1oz (default): track to track 0.102, other pairs 0.152 to 0.3
spacing copperThickness2oz: track to track 0.203, other pairs 0.152 to 0.3
track width copperThickness1oz (default): min 0.127, default 0.254, max 2.54
track width copperThickness2oz: min 0.203, default 0.254, max 2.54
differential pair differentialPair (default): width min 0.127, default 0.254, max 2.54; gap min 0.152, default 0.152
via viaSize (default): diameter min 0.5, default 0.61, max 10; hole min 0.3, default 0.305, max 6.3

## Placement (name value [footprint] x y rotation side)
C68  1uF  [C0603]  170.69 61.34 0 top
C72  10uF  [CAP-SMD_L3.2-W1.6-RD-C7171]  166.62 110.74 270 top
C79  1uF  [C0603]  155.83 53.59 270 top
C80  1uF  [C0603]  153.16 53.59 270 top
C81  2.2nF  [C0603]  153.22 64.39 90 top
C82  1uF  [C0603]  160.66 64.39 270 top
C83  1uF  [C0603]  148.34 64.39 270 top
C84  2.2nF  [C0603]  158.11 64.39 90 top
C85  1uF  [C0603]  125.6 53.59 90 top
C86  220pF  [C0603]  130.18 53.59 90 top
C87  1uF  [C0603]  145.67 53.59 90 top
C88  220pF  [C0603]  141.1 53.59 90 top
C89  10uF  [CAP-SMD_L3.2-W1.6-RD-C7171]  170.56 51.44 180 top
C90  47nF  [C0603]  148.01 109.58 180 top
C91  47nF  [C0603]  148.01 107.04 180 top
C92  47nF  [C0603]  148.01 99.42 180 top
C93  47nF  [C0603]  148.01 101.98 180 top
D1  M7  [SMA_L4.3-W2.6-LS5.2-RD]  129.41 32.77 0 top
D2  M7  [SMA_L4.3-W2.6-LS5.2-RD]  154.81 32.77 0 top
DC2  DC-470-2.1GP  [DC-IN-TH_DC-470-2.1GP]  176.25 109.35 270 bottom
J1  -  [Stereo Switched Jack]  95.25 -0.13 180 bottom
J2  -  [Stereo Switched Jack]  120.65 -0.13 180 bottom
J3  -  [Stereo Switched Jack]  146.05 -0.13 180 bottom
J4  -  [Stereo Switched Jack]  171.45 -0.13 180 bottom
J5  -  [Stereo Switched Jack]  19.05 -0.13 180 bottom
LED1  KT-0603R  [LED0603-RD]  38.1 38.23 90 top
LED2  KT-0603R  [LED0603-RD]  25.4 38.23 90 top
NOREF  -  [Pad_e5218]  186.69 3.81 0 top
NOREF#2  -  [Pad_e5217]  186.69 113.03 0 top
NOREF#3  -  [Pad_e5216]  3.81 3.81 0 top
NOREF#4  -  [Pad_e5215]  3.81 113.03 0 top
PS2  HYC03-MDC603-128B  [CONN-TH_HYC_HYC03-MDC603-128B]  44.45 8.13 180 bottom
Q1  S8050 J3Y(RANGE:200-350)  [SOT-23-3_L3.0-W1.7-P0.95-LS2.9-BR]  171.58 12.32 0 top
Q2  S8050 J3Y(RANGE:200-350)  [SOT-23-3_L3.0-W1.7-P0.95-LS2.9-BR]  171.58 17.15 0 top
R106  10kΩ  [R0603]  137.08 99.42 0 top
R107  10kΩ  [R0603]  137.08 107.04 0 top
R108  10kΩ  [R0603]  137.08 109.58 0 top
R109  10kΩ  [R0603]  137.08 101.96 0 top
R112  10kΩ  [R0603]  141.02 107.04 180 top
R113  10kΩ  [R0603]  141.02 109.58 180 top
R114  10kΩ  [R0603]  141.02 99.42 0 top
R115  10kΩ  [R0603]  141.02 101.96 0 top
R120  100Ω  [R0603]  161.8 47.62 270 top
R121  1MΩ  [R0603]  158.37 53.59 270 top
R122  100Ω  [R0603]  136.53 47.62 270 top
R123  1MΩ  [R0603]  150.62 53.59 270 top
R124  1MΩ  [R0603]  160.66 59.06 90 top
R125  1MΩ  [R0603]  148.34 60.33 90 top
R126  3.3kΩ  [R0603]  150.78 64.39 270 top
R127  3.3kΩ  [R0603]  155.67 64.39 270 top
R128  1MΩ  [R0603]  127.89 53.59 90 top
R129  1MΩ  [R0603]  128.52 46.1 90 top
R130  33kΩ  [R0603]  129.41 56.26 0 top
R131  1MΩ  [R0603]  143.38 53.59 90 top
R132  1MΩ  [R0603]  153.92 46.1 90 top
R133  33kΩ  [R0603]  141.86 56.26 180 top
R138  33kΩ  [R0603]  176.15 57.4 270 top
R139  33kΩ  [R0603]  176.15 53.59 270 top
R140  1kΩ  [R0603]  186.82 94.56 270 top
R141  1kΩ  [R0603]  184.02 94.56 270 top
R142  1kΩ  [R0603]  41.28 88.14 90 top
R143  1kΩ  [R0603]  22.22 88.14 90 top
RL1  M4-12HW  [RELAYS-TH_M4-XXHXX]  129.41 37.97 90 bottom
RL2  M4-12HW  [RELAYS-TH_M4-XXHXX]  154.81 37.97 90 bottom
SW1  -  [Tactile Switch 6mm]  50.8 28.57 0 top
SW2  -  [Tactile Switch 6mm]  38.1 28.57 0 top
SW3  -  [Tactile Switch 6mm]  25.4 28.57 0 top
SW4  -  [Tactile Switch 6mm]  12.7 28.57 0 top
SW5  -  [12mm Encoder]  50.8 42.8 0 top
SW6  -  [12mm Encoder]  12.7 42.8 0 top
U32  -  [Daisy Seed]  136.83 114.66 0 bottom
U33  -  [2.4 TFT Display]  95.25 30.35 0 top
U40  TL072CDT  [SOIC-8_L5.0-W4.0-P1.27-LS6.0-BL]  154.43 59.06 90 top
U41  TL072CDT  [SOIC-8_L5.0-W4.0-P1.27-LS6.0-BL]  135.64 56.26 270 top
U42  TL072CDT  [SOIC-8_L5.0-W4.0-P1.27-LS6.0-BL]  170.69 56.26 270 top
VR1  -  [RD901F]  50.8 61.85 0 top
VR2  -  [RD901F]  31.75 61.85 0 top
VR3  -  [RD901F]  12.7 61.85 0 top
VR4  -  [RD901F]  50.8 80.9 0 top
VR5  -  [RD901F]  31.75 80.9 0 top
VR6  -  [RD901F]  12.7 80.9 0 top

## Footprints (pads in the part's own frame, mm; a bottom-side part is the same pattern mirrored in y, then rotated)
2.4 TFT Display
  rect 1.524x1.524 hole 0.914: 1(-8.875,66.3)
  round 1.524 hole 0.914: 2(-6.335,66.3) 3(-3.795,66.3) 4(-1.255,66.3) 5(1.285,66.3) 6(3.825,66.3) 7(6.365,66.3) 8(8.905,66.3)
  round 3.81 hole 2.083: 9(-18.95,65.8) 9(-18.85,0) 9(18.85,0) 9(18.95,65.8)
12mm Encoder
  round 1.524 hole 0.914: 1(-2.54,0) 2(0,0) 3(2.54,0) 4(2.54,15) 5(-2.54,15)
  oval 1.524x2.6 hole 0.914x2: 6(-4.8,7.5) 7(4.8,7.5)
C0603
  rect 0.8x0.9 smd: 1(-0.7,0) 2(0.7,0)
CAP-SMD_L3.2-W1.6-RD-C7171
  rect 1.758x1.296 smd: 1(-1.687,0) 2(1.687,0)
CONN-TH_HYC_HYC03-MDC603-128B
  rect 1.5x1.6 hole 0.9: 1(-3.25,3.225)
  round 1.5 hole 0.9: 2(3.25,3.225) 3(-3.25,0.425) 4(-1.5,0.425) 5(1.5,0.425) 6(3.25,0.425)
  round 3.1 hole 2.5: 7(-6.85,-2.575) 8(6.85,-2.575)
  oval 3.4x1.4 hole 3x1: 9(0,-3.225)
Daisy Seed
  round 1.524 hole 0.914: 1(7.62,0) 2(7.62,2.54) 3(7.62,5.08) 4(7.62,7.62) 5(7.62,10.16) 6(7.62,12.7) 7(7.62,15.24) 8(7.62,17.78) 9(7.62,20.32) 10(7.62,22.86) 11(7.62,25.4) 12(7.62,27.94) 13(7.62,30.48) 14(7.62,33.02) 15(7.62,35.56) 16(7.62,38.1) 17(7.62,40.64) 18(7.62,43.18) 19(7.62,45.72) 20(7.62,48.26) 21(-7.62,48.26) 22(-7.62,45.72) 23(-7.62,43.18) 24(-7.62,40.64) 25(-7.62,38.1) 26(-7.62,35.56) 27(-7.62,33.02) 28(-7.62,30.48) 29(-7.62,27.94) 30(-7.62,25.4) 31(-7.62,22.86) 32(-7.62,20.32) 33(-7.62,17.78) 34(-7.62,15.24) 35(-7.62,12.7) 36(-7.62,10.16) 37(-7.62,7.62) 38(-7.62,5.08) 39(-7.62,2.54) 40(-7.62,0)
DC-IN-TH_DC-470-2.1GP
  oval 1.5x3.5 hole 1x3: 1(3.1,2.35) 2(-3.1,2.35)
  oval 3.5x1.5 hole 3x1: 3(0.1,-2.35)
LED0603-RD
  rect 0.8x0.8 smd: 1(-0.799,0) 2(0.799,0)
Pad_e5215
  round 5.588 hole 3.048: 1(0,0)
Pad_e5216
  round 5.588 hole 3.048: 1(0,0)
Pad_e5217
  round 5.588 hole 3.048: 1(0,0)
Pad_e5218
  round 5.588 hole 3.048: 1(0,0)
R0603
  rect 0.806x0.864 smd: 1(-0.753,0) 2(0.753,0)
RD901F
  round 1.524 hole 0.914: 1(-2.54,0) 2(0,0) 3(2.54,0)
  oval 1.524x2.6 hole 0.914x2: 4(4.8,7.5) 5(-4.8,7.5)
RELAYS-TH_M4-XXHXX
  round 1.8 hole 1.2: 1(-8.89,-3.81) 4(-1.27,-3.81) 6(3.81,-3.81) 8(8.89,-3.81) 9(8.89,3.81) 11(3.81,3.81) 13(-1.27,3.81) 16(-8.89,3.81)
SMA_L4.3-W2.6-LS5.2-RD
  rect 2x2 smd: 1(-2.2,0) 2(2.2,0)
SOIC-8_L5.0-W4.0-P1.27-LS6.0-BL
  oval 0.569x1.95 smd: 1(-1.905,-2.705) 2(-0.635,-2.705) 3(0.635,-2.705) 4(1.905,-2.705) 5(1.905,2.705) 6(0.635,2.705) 7(-0.635,2.705) 8(-1.905,2.705)
SOT-23-3_L3.0-W1.7-P0.95-LS2.9-BR
  rect 1.038x0.532 smd: 1(1.101,-0.95) 2(1.101,0.95) 3(-1.101,0)
Stereo Switched Jack
  rect 1.27x2.286 hole 0.508x1.397: 1(-8.128,16.637)
  rrect 1.27x2.286 hole 0.508x1.397: 2(-8.128,10.287) 3(-8.128,3.937) 4(8.102,3.937) 5(8.102,10.287) 6(8.102,16.637)
Tactile Switch 6mm
  round 2 hole 1.2: 1(-3.25,2.25) 1(3.25,2.25) 2(-3.25,-2.25) 2(3.25,-2.25)

## Nets
As in the schematic.

Pads without a net: DC2 3; J1 1 2 5; J2 1 2 5; J3 1 2 5; J4 1 2 5; J5 2; NOREF 1; NOREF#2 1; NOREF#3 1; NOREF#4 1; SW5 6 7; SW6 6 7; U33 9; VR1 4 5; VR2 4 5; VR3 4 5; VR4 4 5; VR5 4 5; VR6 4 5

## Via types
v1: diameter 0.61, hole 0.305, Top Layer to Bottom Layer, 20 vias

## Routing (per net, layer and track width the routed paths; a pad name or vN(x,y) marks a point on that pad's centre or on a via; arc(x,y) is an arc through that point)
3V3A: length 288.2
  Top Layer w0.254: VR4.3 51.69,79.25 35.94,79.25 VR5.3 32.64,79.25 16.89,79.25 VR6.3 ; VR1.3 53.34,61.57 51.97,60.2 35.99,60.2 34.34,61.85 VR2.3 32.64,60.2 16.89,60.2 VR3.3 ; VR1.3 112.65,61.85 117.2,66.4 U32.21 ; VR1.3 58.01,57.18 58.01,7.14 52.43,1.55 23.7,1.55 15.09,10.16 J5.5
  Bottom Layer w0.254: VR3.3 VR6.3
3V3D: length 72.3
  Top Layer w0.254: 133.77,107.04 R107.1 ; 133.77,107.04 133.77,101.96 ; 133.77,107.04 133.77,109.56 133.79,109.58 ; 133.77,101.96 133.77,99.42 R106.1 ; 133.77,101.96 R109.1 ; 133.79,109.58 U32.38 ; 133.79,109.58 R108.1
  Bottom Layer w0.254: 88.91,96.65 90.95,94.61 102.12,94.61 117.08,109.58 U32.38
+9V: length 287.5
  Top Layer w0.254: R138.1 176.14,58.17 U42.8 171.96,58.17 171.39,58.74 C68.2 v1(171.36,61.34) ; 173.8,112.45 166.64,112.45 C72.1 157.44,112.43 156.49,113.39 132.44,113.39 131.17,112.12 U32.39 ; v1(151.73,57.15) 145.8,57.15 144.78,58.17 U41.8
  Top Layer w0.508: RL2.1 151,31.16 D2.1 154.81,34.97 v1(154.81,37.85) 153.48,39.18 130.87,39.18 129.54,37.85 129.54,35.09 125.6,31.16 RL1.1
  Bottom Layer w0.254: v1(151.73,57.15) 167.17,57.15 v1(171.36,61.34) ; C68.2 171.39,110.93 172.9,112.45 DC2.2
  Bottom Layer w0.508: DC2.2 173.9,110.02 179.45,104.47 179.45,41.66 176.91,39.12 156.08,39.12 v1(154.81,37.85)
CS: length 59.5
  Top Layer w0.254: 101.62,96.65 110.28,87.99 146.23,87.99 147.17,88.93 147.17,95.71 146,96.88 U32.8
DC: length 50.5
  Top Layer w0.254: U32.13 140.74,84.18 139.47,85.45 110.28,85.45 99.07,96.65
ENC1_A: length 5.5
  Top Layer w0.254: R113.1 U32.3 C90.2
ENC1_B: length 5.5
  Top Layer w0.254: C91.2 U32.4 R112.1
ENC1_CLK: length 286.8
  Bottom Layer w0.254: U32.2 137.57,112.12 133.76,108.31 118.75,108.31 103.58,93.14 66.75,93.14 62.86,97.03 3.05,97.03 1.27,95.25 1.27,41.78 9.52,33.53 48.26,33.53 57.15,42.42 57.15,53.99 SW5.4
ENC2_A: length 5.5
  Top Layer w0.254: C92.2 U32.7 R114.2
ENC2_B: length 5.5
  Top Layer w0.254: 147.31,101.96 U32.6 R115.2
ENC2_CLK: length 178
  Bottom Layer w0.254: SW6.5 8.26,59.7 8.26,65.28 9.52,66.55 9.52,72.9 8.26,74.17 8.26,84.96 13.97,90.68 59.69,90.68 65.41,84.96 117.35,84.96 127.95,95.57 127.95,95.61 135.56,95.61 U32.5
EXP: length 146.3
  Bottom Layer w0.254: U32.28 124.82,84.18 62.86,22.22 19.05,22.22 13.34,16.51 J5.6
EXP_IN: length 176.5
  Bottom Layer w0.254: U32.29 125.45,86.72 62.23,23.5 13.97,23.5 8.89,18.41 8.89,14.6 10.16,13.34 19.69,13.34 27.31,5.72 27.31,3.94 J5.3
IN_L: length 25.2
  Top Layer w0.254: 132.93,56.9 132.93,59.02 140.21,66.29 140.21,73.61 143.15,76.56 U32.16
IN_R: length 24.3
  Top Layer w0.254: U32.17 144.35,74.12 143.15,74.12 141.48,72.44 141.48,64.64 136.4,59.56 136.4,57.4 136.91,56.9 U41.7 U41.6
JI_L: length 9
  Top Layer w0.254: R129.2 128.52,46.86 RL1.8 C85.1
JI_R: length 11.2
  Top Layer w0.254: R132.2 153.92,46.86 RL2.8
  Bottom Layer w0.254: RL2.8 145.67,52.2 v1(145.67,52.89)
JIL_IN: length 188.7
  Top Layer w0.254: U32.14 167.28,81.64 181.61,67.31 181.61,2.54 180.34,1.27 104.14,1.27 103.38,2.03 J1.3
JIR_IN: length 146.2
  Top Layer w0.254: J2.3 128.78,5.59 130.18,6.99 172.09,6.99 177.8,12.7 177.8,66.67 165.38,79.1 U32.15
JO_L: length 3.3
  Top Layer w0.254: R122.2 136.52,46.86 RL1.9
JO_R: length 3.2
  Top Layer w0.254: R120.2 161.79,46.86 RL2.9
JOL_IN: length 142.6
  Bottom Layer w0.254: U32.31 130.48,91.8 133.02,89.26 133.02,63.02 109.22,39.22 109.22,9.53 111.76,6.99 152.4,6.99 154.18,5.21 J3.3
JOR_IN: length 170.9
  Bottom Layer w0.254: J4.3 179.58,2.36 178.49,1.27 111.76,1.27 107.95,5.08 107.95,41.12 131.75,64.92 131.75,87.99 130.48,89.26 U32.30
MOSI: length 85.4
  Bottom Layer w0.254: 94,96.65 108.14,110.8 133.78,110.8 136.37,113.39 146.05,113.39 147.17,112.27 147.17,90.7 145.72,89.26 U32.11
OUT_L: length 18.4
  Top Layer w0.254: R126.1 150.78,66.29 150.14,66.93 147.45,66.93 145.16,64.64 143.51,64.64 142.49,65.66 142.49,70.69 143.28,71.48 U32.18
OUT_R: length 13.5
  Top Layer w0.254: R127.1 155.65,65.16 155.65,66.34 153.06,68.94 U32.19
POT1: length 81.3
  Top Layer w0.254: U32.22 128.86,68.58 113.8,68.58 109.22,64.01 52.96,64.01 VR1.2
POT2: length 101.4
  Top Layer w0.254: U32.23 114.78,71.48 108.59,65.28 35.18,65.28 VR2.2
POT3: length 121.5
  Top Layer w0.254: U32.24 115.42,74.02 107.95,66.55 17.4,66.55 VR3.2
POT4: length 82
  Top Layer w0.254: VR4.2 52.96,83.06 59.13,83.06 65.63,76.56 U32.25
POT5: length 101
  Top Layer w0.254: VR5.2 35.18,84.33 60.2,84.33 65.43,79.1 U32.26
POT6: length 120.1
  Top Layer w0.254: VR6.2 17.4,85.6 61.34,85.6 65.3,81.64 U32.27
RLY1: length 49.5
  Top Layer w0.508: Q1.3 148.34,12.32 133.22,27.43 RL1.16 133.22,31.16 D1.2
RLY2: length 22.1
  Top Layer w0.508: D2.2 158.62,31.16 RL2.16 158.62,27.43 168.91,17.15 Q2.3
RST: length 60.9
  Top Layer w0.254: 96.53,96.65 110.31,82.88 145.85,82.88 146.58,83.62 146.58,86.03 145.9,86.72 U32.12
SCK: length 58.8
  Top Layer w0.254: U32.9 142.77,94.34 138.96,90.53 113.49,90.53 105.28,98.73 93.53,98.73 91.46,96.65
SW1: length 256
  Top Layer w0.254: SW1.1 SW1.1 ; SW1.1 45.44,28.72 45.44,17.83 47.7,15.57 PS2.1 ; SW1.1 42.94,35.43 13.97,35.43 5.72,43.69 5.72,90.68 22.78,107.75 113.16,107.75 121.49,99.42 U32.34
SW2: length 247.2
  Top Layer w0.254: PS2.2 41.2,15.65 43.54,17.98 43.54,28.64 SW2.1 SW2.1 31.51,34.16 12.83,34.16 4.45,42.55 4.45,92.08 21.23,108.86 114.27,108.86 121.18,101.96 U32.35
SW3: length 247.2
  Top Layer w0.254: U32.36 120.93,104.5 115.11,110.31 20.14,110.31 3.17,93.34 3.17,41.15 11.43,32.89 20.08,32.89 SW3.1 SW3.1 31.32,28.16 31.32,17.4 38.91,9.8 41.7,9.8 PS2.5
SW4: length 247.8
  Top Layer w0.254: U32.37 120.5,107.04 115.88,111.66 18.95,111.66 1.91,94.61 1.91,39.88 9.45,32.33 SW4.1 SW4.1 18.52,28.26 18.52,22 31.96,8.55 PS2.6
VREF: length 52.2
  Top Layer w0.254: R128.1 130.12,52.84 C86.1 C88.1 143.33,52.89 v1(143.38,52.84) ; U42.7 v1(173.39,55.63) 164.21,55.63 161.54,58.3 R124.1
  Bottom Layer w0.254: v1(160.66,58.26) 159.38,59.53 v1(148.34,59.53) 148.34,57.79 v1(143.38,52.84)
$10N6382: length 58.2
  Top Layer w0.254: R140.1 R141.1 184.02,108.61 177.98,114.66 U32.1
$10N6679: length 99.5
  Top Layer w0.254: U32.32 121.97,94.34 112.01,104.29 54.89,104.29 41.28,90.68 R142.2
$10N6682: length 119
  Top Layer w0.254: U32.33 121.89,96.88 112.67,106.1 37.64,106.1 22.22,90.68 R143.2
$10N7125: length 8.5
  Top Layer w0.254: R138.2 R139.1 176.14,54.36 U42.5 173.39,53.76 172.25,52.61 C89.1
$10N7367: length 1.3
  Top Layer w0.254: 167.98,56.9 167.98,58.17
$10N7624: length 88.3
  Bottom Layer w0.254: v1(186.82,93.79) 186.82,28.45 174.62,16.26 174.62,13.32 v1(172.68,11.37)
$10N7628: length 82.3
  Bottom Layer w0.254: v1(184.02,93.76) 184.02,27.54 v1(172.68,16.19)
$10N7932: length 49.6
  Bottom Layer w0.254: v1(25.4,39.03) 22.22,42.2 v1(22.22,87.34)
$10N7953: length 49.6
  Bottom Layer w0.254: v1(41.28,87.28) 41.28,42.2 v1(38.1,39.03)
$11N804: length 8.5
  Top Layer w0.254: C79.2 158.32,52.89 R121.2 158.4,52.84 161.8,49.44 R120.1
$11N837: length 4.7
  Top Layer w0.254: U40.2 U40.1 157.14,56.3 155.83,54.99 C79.1
$11N1101: length 18.5
  Top Layer w0.254: C80.2 153.11,52.84 R123.2 149.23,52.84 144.77,48.38 R122.1
$11N1104: length 6.7
  Top Layer w0.254: C80.1 153.16,58.17 152.91,58.42 151.73,58.42 151.73,59.69
$11N1398: length 6.1
  Top Layer w0.254: C83.2 R125.2 148.45,60.96 151.73,60.96
$11N1403: length 7.4
  Top Layer w0.254: C82.2 R124.2 160.54,59.69 U40.3
$11N1606: length 5.6
  Top Layer w0.254: R127.2 158.06,63.64 C84.1 158.69,63.69 160.15,65.15 160.59,65.15 C82.1
$11N1632: length 5.5
  Top Layer w0.254: C83.1 148.78,65.09 150.23,63.64 R126.2 150.83,63.69 C81.1
$11N2089: length 4.5
  Top Layer w0.254: R130.1 127.89,55.49 R128.2 127.84,54.29 C85.2
$11N2090: length 5
  Top Layer w0.254: C86.2 130.18,56.25 R130.2 131.06,56.26 131.7,55.63 132.93,55.63
$11N2346: length 4.5
  Top Layer w0.254: C87.2 145.62,54.35 R131.2 143.38,55.49 R133.1
$11N2347: length 4.8
  Top Layer w0.254: U41.5 141.03,54.36 C88.2 141.1,56.25 R133.2
$11N2676: length 7.6
  Top Layer w0.254: RL1.6 RL1.11
$11N2773: length 7.6
  Top Layer w0.254: RL2.6 RL2.11
$11N2916: length 47.4
  Top Layer w0.254: J1.6 87.15,18.57 105.28,36.7 124.97,36.7
$11N2921: length 22.4
  Bottom Layer w0.254: 132.59,36.7 137.95,31.34 J3.6
$11N2943: length 57.4
  Bottom Layer w0.254: J2.6 114.94,16.51 118.75,12.7 139.7,12.7 146.05,19.05 146.05,31.75 RL2.4
$11N2980: length 22.1
  Bottom Layer w0.254: RL2.13 163.35,31.98 J4.6
$13N692: length 191.4
  Top Layer w0.254: v1(137.84,99.42) R114.1
  Bottom Layer w0.254: SW6.1 6.35,46.61 6.35,90.04 8.26,91.95 60.33,91.95 66.04,86.23 116.08,86.23 127.99,98.15 135.93,98.15 137.2,99.42 v1(137.84,99.42)
$13N693: length 202.7
  Top Layer w0.254: v1(137.84,101.96) R115.1
  Bottom Layer w0.254: SW6.3 13.59,41.15 9.52,41.15 5.08,45.59 5.08,91.31 6.98,93.22 60.96,93.22 66.67,87.5 114.81,87.5 127.99,100.69 136.57,100.69 v1(137.84,101.96)
$13N699: length 252.4
  Top Layer w0.254: v1(137.84,107.04) R112.2
  Bottom Layer w0.254: SW5.3 51.82,44.32 46.99,44.32 38.73,36.07 12.06,36.07 3.81,44.32 3.81,92.58 5.72,94.49 61.59,94.49 67.31,88.77 113.54,88.77 127.99,103.23 134.03,103.23 v1(137.84,107.04)
$13N700: length 252.1
  Top Layer w0.254: v1(137.88,109.58) R113.2
  Bottom Layer w0.254: v1(137.88,109.58) 134.07,105.77 127.95,105.77 127.95,105.73 112.4,90.17 67.82,90.17 62.23,95.76 4.45,95.76 2.54,93.85 2.54,43.05 10.8,34.8 40.26,34.8 SW5.1

## Copper pours and planes (outline as drawn; the poured copper is in the pictures)
GND on Top Layer: 0,116.84 190.5,116.84 190.5,0 0,0
GND on Bottom Layer: 0,116.84 190.5,116.84 190.5,-0.05 0,-0.05
